# Altium project RK_NVR_DEMO1_RK3588_LP4XD200P232SD8_V21_20211228.PrjPcb (part 8 of 19)

## Sheet 25.USB2_USB3_TypeC Port.SchDoc
size 594 x 420 mm; Revision: V2.1; Schematic Page Number: 11; Page Number: 23; Check: Default; Schematic Name: RK_NVR_DEMO1_RK3588_LP4/4x_V21; Page Count: 43; Page name: 25.USB2/USB3/TypeC Port; Designer: Zhangdz; Schematic Page Count: 99; Revcode: V2.1; DsnPath: E:\Work\SBER\RK3588_SOM\temp\RK_NVR_DEMO1_RK3588_LP4XD200P232SD8_V21_20211228.DSN; SchematicName: RK_NVR_DEMO1_RK3588_LP4/4x_V21; PageName: 25.USB2/USB3/TypeC Port; PageSize: A2; TopSchematic: True
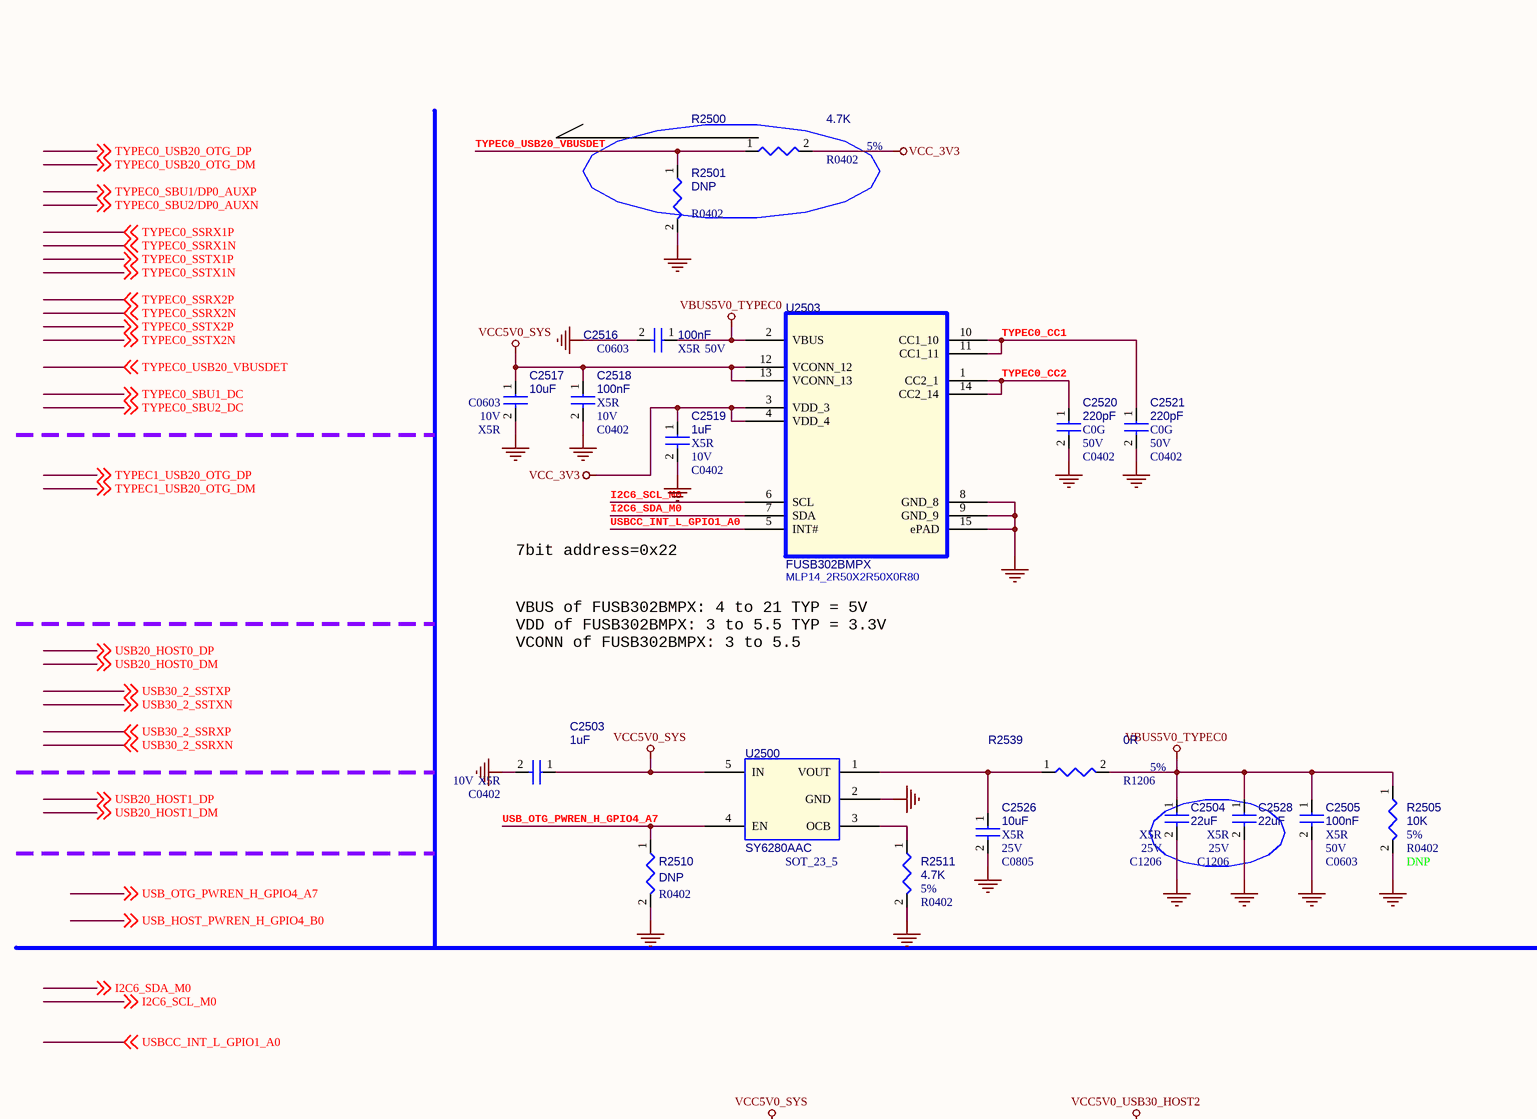
[diagram p44: 25.USB2_USB3_TypeC Port.SchDoc, top left]
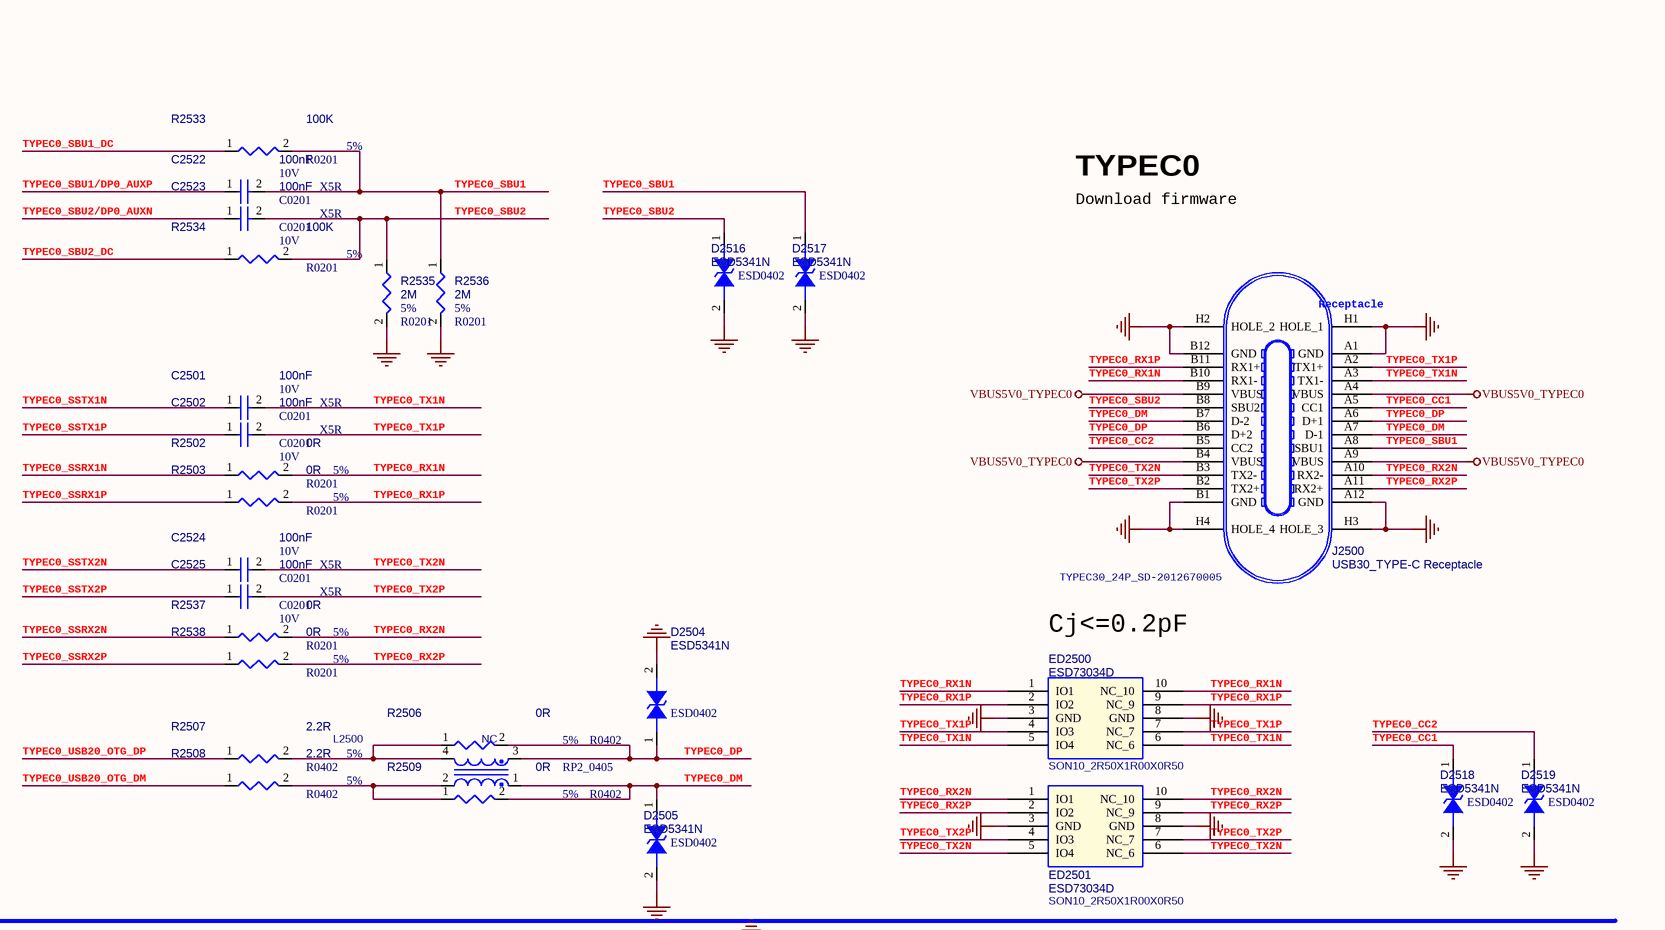
[diagram p45: 25.USB2_USB3_TypeC Port.SchDoc, top right]
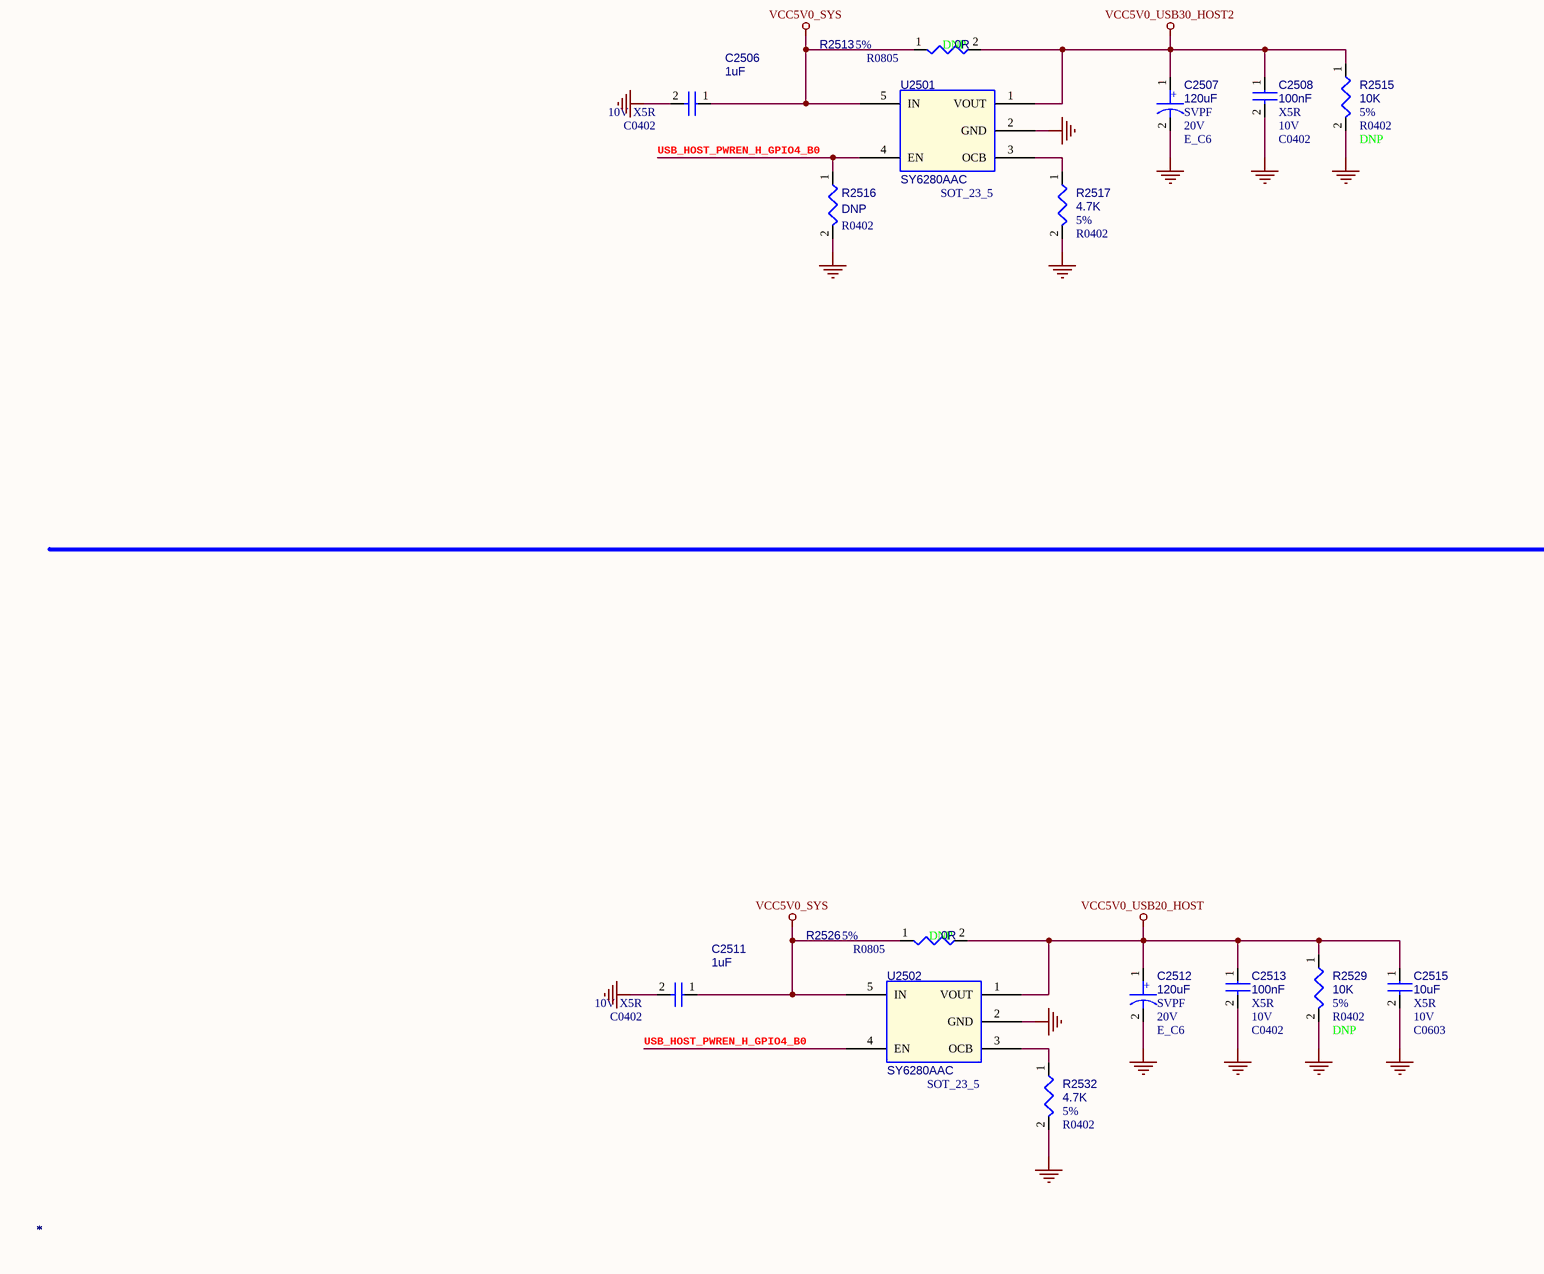
[diagram p46: 25.USB2_USB3_TypeC Port.SchDoc, bottom left]
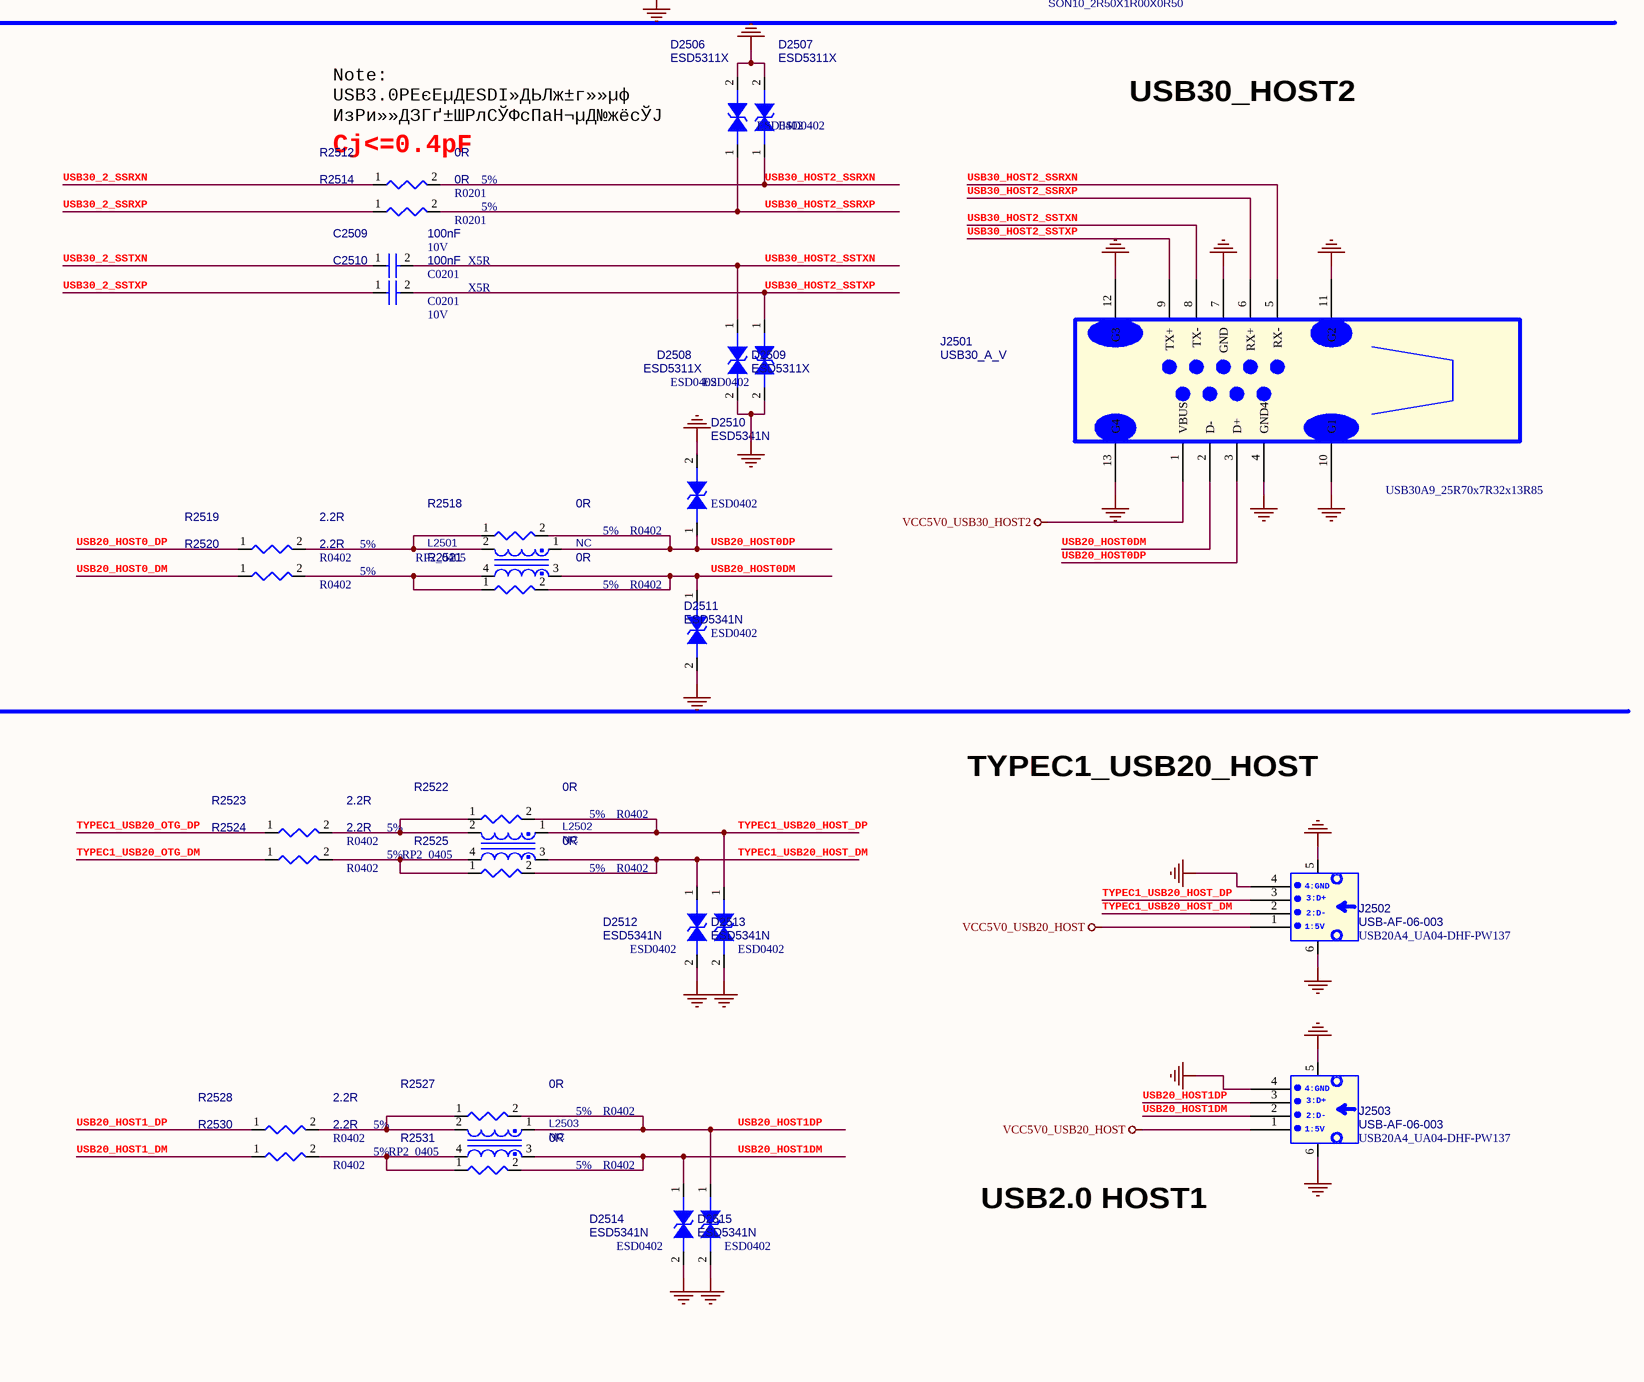
[diagram p47: 25.USB2_USB3_TypeC Port.SchDoc, bottom right]

### Parts
C2501  *  Voltage: 10V  Dielectric: X5R  [C0201]
C2502  *  Voltage: 10V  Dielectric: X5R  [C0201]
C2503  *  Voltage: 10V  Dielectric: X5R  [C0402]
C2504  *  Voltage: 25V  Dielectric: X5R  [C1206]
C2505  *  Voltage: 50V  Dielectric: X5R  [C0603]
C2506  *  Voltage: 10V  Dielectric: X5R  [C0402]
C2507  *  Voltage: 20V  Dielectric: SVPF  [E_C6]
C2508  *  Voltage: 10V  Dielectric: X5R  [C0402]
C2509  *  Voltage: 10V  Dielectric: X5R  [C0201]
C2510  *  Voltage: 10V  Dielectric: X5R  [C0201]
C2511  *  Voltage: 10V  Dielectric: X5R  [C0402]
C2512  *  Voltage: 20V  Dielectric: SVPF  [E_C6]
C2513  *  Voltage: 10V  Dielectric: X5R  [C0402]
C2515  *  Voltage: 10V  Dielectric: X5R  [C0603]
C2516  *  Voltage: 50V  Dielectric: X5R  [C0603]
C2517  *  Voltage: 10V  Dielectric: X5R  [C0603]
C2518  *  Voltage: 10V  Dielectric: X5R  [C0402]
C2519  *  Voltage: 10V  Dielectric: X5R  [C0402]
C2520  *  Voltage: 50V  Dielectric: C0G  [C0402]
C2521  *  Voltage: 50V  Dielectric: C0G  [C0402]
C2522  *  Voltage: 10V  Dielectric: X5R  [C0201]
C2523  *  Voltage: 10V  Dielectric: X5R  [C0201]
C2524  *  Voltage: 10V  Dielectric: X5R  [C0201]
C2525  *  Voltage: 10V  Dielectric: X5R  [C0201]
C2526  *  Voltage: 25V  Dielectric: X5R  [C0805]
C2528  *  Voltage: 25V  Dielectric: X5R  [C1206]
D2504  *  [ESD0402]
D2505  *  [ESD0402]
D2506  *  [ESD0402]
D2507  *  [ESD0402]
D2508  *  [ESD0402]
D2509  *  [ESD0402]
D2510  *  [ESD0402]
D2511  *  [ESD0402]
D2512  *  [ESD0402]
D2513  *  [ESD0402]
D2514  *  [ESD0402]
D2515  *  [ESD0402]
D2516  *  [ESD0402]
D2517  *  [ESD0402]
D2518  *  [ESD0402]
D2519  *  [ESD0402]
ED2500  *  [SON10_2R50X1R00X0R50]
ED2501  *  [SON10_2R50X1R00X0R50]
J2500  *  [TYPEC30_24P_SD-2012670005]
J2501  *  PCB Footprint: USB30A9_25R70x7R32x13R85  [USB30]
J2502  *  PCB Footprint: USB20A4_UA04-DHF-PW137  [USB20]
J2503  *  PCB Footprint: USB20A4_UA04-DHF-PW137  [USB20]
L2500  *  PCB Footprint: RP2_0405  [L0402D]
L2501  *  PCB Footprint: RP2_0405  [L0402D]
L2502  *  PCB Footprint: RP2_0405  [L0402D]
L2503  *  PCB Footprint: RP2_0405  [L0402D]
R2500  *  Tolerance: 5%  [R0402]
R2501  *  [R0402]
R2502  *  PCB Footprint: R0201  Tolerance: 5%  [R0402]
R2503  *  PCB Footprint: R0201  Tolerance: 5%  [R0402]
R2505  *  Tolerance: 5%  option: DNP  [R0402]
R2506  *  Tolerance: 5%  [R0402]
R2507  *  Tolerance: 5%  [R0402]
R2508  *  Tolerance: 5%  [R0402]
R2509  *  Tolerance: 5%  [R0402]
R2510  *  [R0402]
R2511  *  Tolerance: 5%  [R0402]
R2512  *  PCB Footprint: R0201  Tolerance: 5%  [R0402]
R2513  *  PCB Footprint: R0805  Tolerance: 5%  Option: DNP  [R0402]
R2514  *  PCB Footprint: R0201  Tolerance: 5%  [R0402]
R2515  *  Tolerance: 5%  option: DNP  [R0402]
R2516  *  [R0402]
R2517  *  Tolerance: 5%  [R0402]
R2518  *  Tolerance: 5%  [R0402]
R2519  *  Tolerance: 5%  [R0402]
R2520  *  Tolerance: 5%  [R0402]
R2521  *  Tolerance: 5%  [R0402]
R2522  *  Tolerance: 5%  [R0402]
R2523  *  Tolerance: 5%  [R0402]
R2524  *  Tolerance: 5%  [R0402]
R2525  *  Tolerance: 5%  [R0402]
R2526  *  PCB Footprint: R0805  Tolerance: 5%  Option: DNP  [R0402]
R2527  *  Tolerance: 5%  [R0402]
R2528  *  Tolerance: 5%  [R0402]
R2529  *  Tolerance: 5%  option: DNP  [R0402]
R2530  *  Tolerance: 5%  [R0402]
R2531  *  Tolerance: 5%  [R0402]
R2532  *  Tolerance: 5%  [R0402]
R2533  *  PCB Footprint: R0201  Tolerance: 5%  [R0402]
R2534  *  PCB Footprint: R0201  Tolerance: 5%  [R0402]
R2535  *  PCB Footprint: R0201  Tolerance: 5%  [R0402]
R2536  *  PCB Footprint: R0201  Tolerance: 5%  [R0402]
R2537  *  PCB Footprint: R0201  Tolerance: 5%  [R0402]
R2538  *  PCB Footprint: R0201  Tolerance: 5%  [R0402]
R2539  *  PCB Footprint: R1206  Tolerance: 5%  [R0402]
U2500  *  [SOT_23_5]
U2501  *  [SOT_23_5]
U2502  *  [SOT_23_5]
U2503  *  [MLP14_2R50X2R50X0R80]

### Nets
GND: C2503.2 C2504.2 C2505.2 C2506.2 C2507.2 C2508.2 C2511.2 C2512.2 C2513.2 C2515.2 C2516.2 C2517.2 C2518.2 C2519.2 C2520.2 C2521.2 C2526.2 C2528.2 D2504.2 D2505.2 D2506.2 D2507.2 D2508.2 D2509.2 D2510.2 D2511.2 D2512.2 D2513.2 D2514.2 D2515.2 D2516.2 D2517.2 D2518.2 D2519.2 ED2500.3(GND) ED2500.8(GND) ED2501.3(GND) ED2501.8(GND) J2500.A1(GND) J2500.A12(GND) J2500.B1(GND) J2500.B12(GND) J2500.H1(HOLE_1) J2500.H2(HOLE_2) J2500.H3(HOLE_3) J2500.H4(HOLE_4) J2501.4(GND4) J2501.7(GND) J2501.10(G1) J2501.11(G2) J2501.12(G3) J2501.13(G4) J2502.4 J2502.5 J2502.6 J2503.4 J2503.5 J2503.6 R2501.2 R2505.2 R2510.2 R2511.2 R2515.2 R2516.2 R2517.2 R2529.2 R2532.2 R2535.2 R2536.2 U2500.2(GND) U2501.2(GND) U2502.2(GND) U2503.8(GND_8) U2503.9(GND_9) U2503.15(ePAD)
VBUS5V0_TYPEC0: C2504.1 C2505.1 C2516.1 C2528.1 J2500.A4(VBUS) J2500.A9(VBUS) J2500.B4(VBUS) J2500.B9(VBUS) R2505.1 R2539.2 U2503.2(VBUS)
VCC5V0_SYS: C2503.1 C2506.1 C2511.1 C2517.1 C2518.1 R2513.1 R2526.1 U2500.5(IN) U2501.5(IN) U2502.5(IN) U2503.12(VCONN_12) U2503.13(VCONN_13)
VCC5V0_USB20_HOST: C2512.1 C2513.1 C2515.1 J2502.1 J2503.1 R2526.2 R2529.1 U2502.1(VOUT)
VCC5V0_USB30_HOST2: C2507.1 C2508.1 J2501.1(VBUS) R2513.2 R2515.1 U2501.1(VOUT)
VCC_3V3: C2519.1 R2500.2 U2503.3(VDD_3) U2503.4(VDD_4)
I2C6_SCL_M0: U2503.6(SCL) ; off-sheet I2C6_SCL_M0
I2C6_SDA_M0: U2503.7(SDA) ; off-sheet I2C6_SDA_M0
TYPEC0_CC1: C2521.1 D2518.1 J2500.A5(CC1) U2503.10(CC1_10) U2503.11(CC1_11)
TYPEC0_CC2: C2520.1 D2519.1 J2500.B5(CC2) U2503.1(CC2_1) U2503.14(CC2_14)
TYPEC0_DM: D2505.1 J2500.A7(D-1) J2500.B7(D-2) L2500.1 R2509.2
TYPEC0_DP: D2504.1 J2500.A6(D+1) J2500.B6(D+2) L2500.3 R2506.2
TYPEC0_RX1N: ED2500.1(IO1) ED2500.10(NC_10) J2500.B10(RX1-) R2502.2
TYPEC0_RX1P: ED2500.2(IO2) ED2500.9(NC_9) J2500.B11(RX1+) R2503.2
TYPEC0_RX2N: ED2501.1(IO1) ED2501.10(NC_10) J2500.A10(RX2-) R2537.2
TYPEC0_RX2P: ED2501.2(IO2) ED2501.9(NC_9) J2500.A11(RX2+) R2538.2
TYPEC0_SBU1: C2522.2 D2517.1 J2500.A8(SBU1) R2533.2 R2536.1
TYPEC0_SBU1/DP0_AUXP: C2522.1 ; off-sheet TYPEC0_SBU1/DP0_AUXP
TYPEC0_SBU1_DC: R2533.1 ; off-sheet TYPEC0_SBU1_DC
TYPEC0_SBU2: C2523.2 D2516.1 J2500.B8(SBU2) R2534.2 R2535.1
TYPEC0_SBU2/DP0_AUXN: C2523.1 ; off-sheet TYPEC0_SBU2/DP0_AUXN
TYPEC0_SBU2_DC: R2534.1 ; off-sheet TYPEC0_SBU2_DC
TYPEC0_SSRX1N: R2502.1 ; off-sheet TYPEC0_SSRX1N
TYPEC0_SSRX1P: R2503.1 ; off-sheet TYPEC0_SSRX1P
TYPEC0_SSRX2N: R2537.1 ; off-sheet TYPEC0_SSRX2N
TYPEC0_SSRX2P: R2538.1 ; off-sheet TYPEC0_SSRX2P
TYPEC0_SSTX1N: C2501.1 ; off-sheet TYPEC0_SSTX1N
TYPEC0_SSTX1P: C2502.1 ; off-sheet TYPEC0_SSTX1P
TYPEC0_SSTX2N: C2524.1 ; off-sheet TYPEC0_SSTX2N
TYPEC0_SSTX2P: C2525.1 ; off-sheet TYPEC0_SSTX2P
TYPEC0_TX1N: C2501.2 ED2500.5(IO4) ED2500.6(NC_6) J2500.A3(TX1-)
TYPEC0_TX1P: C2502.2 ED2500.4(IO3) ED2500.7(NC_7) J2500.A2(TX1+)
TYPEC0_TX2N: C2524.2 ED2501.5(IO4) ED2501.6(NC_6) J2500.B3(TX2-)
TYPEC0_TX2P: C2525.2 ED2501.4(IO3) ED2501.7(NC_7) J2500.B2(TX2+)
TYPEC0_USB20_OTG_DM: R2508.1 ; off-sheet TYPEC0_USB20_OTG_DM
TYPEC0_USB20_OTG_DP: R2507.1 ; off-sheet TYPEC0_USB20_OTG_DP
TYPEC0_USB20_VBUSDET: R2500.1 R2501.1 ; off-sheet TYPEC0_USB20_VBUSDET
TYPEC1_USB20_HOST_DM: D2512.1 J2502.2 L2502.3 R2525.2
TYPEC1_USB20_HOST_DP: D2513.1 J2502.3 L2502.1 R2522.2
TYPEC1_USB20_OTG_DM: R2524.1 ; off-sheet TYPEC1_USB20_OTG_DM
TYPEC1_USB20_OTG_DP: R2523.1 ; off-sheet TYPEC1_USB20_OTG_DP
USB20_HOST0_DM: R2520.1 ; off-sheet USB20_HOST0_DM
USB20_HOST0_DP: R2519.1 ; off-sheet USB20_HOST0_DP
USB20_HOST0DM: D2511.1 J2501.2(D-) L2501.3 R2521.2
USB20_HOST0DP: D2510.1 J2501.3(D+) L2501.1 R2518.2
USB20_HOST1_DM: R2530.1 ; off-sheet USB20_HOST1_DM
USB20_HOST1_DP: R2528.1 ; off-sheet USB20_HOST1_DP
USB20_HOST1DM: D2514.1 J2503.2 L2503.3 R2531.2
USB20_HOST1DP: D2515.1 J2503.3 L2503.1 R2527.2
USB30_2_SSRXN: R2512.1 ; off-sheet USB30_2_SSRXN
USB30_2_SSRXP: R2514.1 ; off-sheet USB30_2_SSRXP
USB30_2_SSTXN: C2509.1 ; off-sheet USB30_2_SSTXN
USB30_2_SSTXP: C2510.1 ; off-sheet USB30_2_SSTXP
USB30_HOST2_SSRXN: D2507.1 J2501.5(RX-) R2512.2
USB30_HOST2_SSRXP: D2506.1 J2501.6(RX+) R2514.2
USB30_HOST2_SSTXN: C2509.2 D2508.1 J2501.8(TX-)
USB30_HOST2_SSTXP: C2510.2 D2509.1 J2501.9(TX+)
USB_HOST_PWREN_H_GPIO4_B0: R2516.1 U2501.4(EN) U2502.4(EN) ; off-sheet USB_HOST_PWREN_H_GPIO4_B0
USB_OTG_PWREN_H_GPIO4_A7: R2510.1 U2500.4(EN) ; off-sheet USB_OTG_PWREN_H_GPIO4_A7
USBCC_INT_L_GPIO1_A0: U2503.5(INT#) ; off-sheet USBCC_INT_L_GPIO1_A0
NetC2526_1: C2526.1 R2539.1 U2500.1(VOUT)
NetL2500_2: L2500.2 R2508.2 R2509.1
NetL2500_4: L2500.4 R2506.1 R2507.2
NetL2501_2: L2501.2 R2518.1 R2519.2
NetL2501_4: L2501.4 R2520.2 R2521.1
NetL2502_2: L2502.2 R2522.1 R2523.2
NetL2502_4: L2502.4 R2524.2 R2525.1
NetL2503_2: L2503.2 R2527.1 R2528.2
NetL2503_4: L2503.4 R2530.2 R2531.1
NetR2511_1: R2511.1 U2500.3(OCB)
NetR2517_1: R2517.1 U2501.3(OCB)
NetR2532_1: R2532.1 U2502.3(OCB)

### Notes on the sheet
- TYPEC0
- Download firmware
- 7bit address=0x22
- VBUS of FUSB302BMPX: 4 to 21 TYP = 5V
  VDD of FUSB302BMPX: 3 to 5.5 TYP = 3.3V
  VCONN of FUSB302BMPX: 3 to 5.5
- (near ED2500) Cj<=0.2pF
- Note:
  USB3.0РЕєЕµДESDІ»ДЬЛж±г»»µф
  ИзРи»»ДЗГґ±ШРлСЎФсПаН¬µД№жёсЎЈ
- USB30_HOST2
- (near R2512) Cj<=0.4pF
- TYPEC1_USB20_HOST
- USB2.0 HOST1
- (in symbol CAP) +
- (in symbol USB20_TYPE_A) 4:GND; 3:D+; 2:D-; 1:5V
- (in symbol USB30_TYPE-C Receptacle_0) Receptacle

### Library data of the parts
C2501 = CAP NP: cap,100.00nF,+/-10%,10V,X5R,C0201; Part Reference: C2501; Manufacturer PN: C0603X5R1A104K030BC; Manufacturer: TDK; Value: 100nF; C_Voltage: 6.3V; Tolerance: 10%; Priority: A; Number: 37; PCB Footprint: C0201; Created by: JJJ; Part Type: C0201; RK PN: C0603X5R1A104K030BC
C2502 = CAP NP: cap,100.00nF,+/-10%,10V,X5R,C0201; Part Reference: C2502; Manufacturer PN: C0603X5R1A104K030BC; Manufacturer: TDK; Value: 100nF; C_Voltage: 6.3V; Tolerance: 10%; Priority: A; Number: 37; PCB Footprint: C0201; Created by: JJJ; Part Type: C0201; RK PN: C0603X5R1A104K030BC
C2503 = CAP NP: cap,1.00uF,+/-10%,10V,X5R,C0402; Part Reference: C2503; Manufacturer PN: C1005X5R1A105K050BB; Manufacturer: TDK; Value: 1uF; Tolerance: 10%; C_Voltage: 6.3V; Priority: A; PCB Footprint: C0402; Created by: JJJ; Part Type: C0402; RK PN: C1005X5R1A105K050BB
C2504 = CAP NP: cap,22.00uF,+/-20%,25V,X5R,C1206; Part Reference: C2504; Manufacturer PN: C3216X5R1E226M160AB; Manufacturer: TDK; Value: 22uF; Tolerance: 20%; C_Voltage: 6.3V; Priority: A; PCB Footprint: C1206; Created by: JJJ; Part Type: C1206; RK PN: C3216X5R1E226M160AB
C2505 = CAP NP: cap,100.00nF,+/-10%,50V,X5R,C0603; Part Reference: C2505; Manufacturer: TDK; Value: 100nF; RK PN: C1608X5R1H104K080AA; Priority: A; Tolerance: 10%; PCB Footprint: C0603; Part Type: C0603; Manufacturer PN: C1608X5R1H104K080AA; Created by: JJJ
C2506 = CAP NP: cap,1.00uF,+/-10%,10V,X5R,C0402; Part Reference: C2506; Manufacturer PN: C1005X5R1A105K050BB; Manufacturer: TDK; Value: 1uF; Tolerance: 10%; C_Voltage: 6.3V; Priority: A; PCB Footprint: C0402; Created by: JJJ; Part Type: C0402; RK PN: C1005X5R1A105K050BB
C2507 = CAP: 120uF,20V,25mR,SVPF; Part Reference: C2507; Manufacturer: Panasonic; RK PN: 20SVPF120M; Priority: A; Tolerance: 20%; PCB Footprint: E_C6; Value: 120uF; Part Type: МщЖ¬№ММ¬ВБµзЅв; Manufacturer PN: 20SVPF120M; Created by: YWQ
C2508 = CAP NP: cap,100.00nF,+/-10%,10V,X5R,C0402; Part Reference: C2508; Manufacturer PN: C1005X5R1A104K050BA; Manufacturer: TDK; Value: 100nF; Tolerance: 10%; Priority: A; PCB Footprint: C0402; Created by: JJJ; Part Type: C0402; RK PN: C1005X5R1A104K050BA
C2509 = CAP NP: cap,100.00nF,+/-10%,10V,X5R,C0201; Part Reference: C2509; Manufacturer PN: C0603X5R1A104K030BC; Manufacturer: TDK; Value: 100nF; C_Voltage: 6.3V; Tolerance: 10%; Priority: A; Number: 37; PCB Footprint: C0201; Created by: JJJ; Part Type: C0201; RK PN: C0603X5R1A104K030BC
C2510 = CAP NP: cap,100.00nF,+/-10%,10V,X5R,C0201; Part Reference: C2510; Manufacturer PN: C0603X5R1A104K030BC; Manufacturer: TDK; Value: 100nF; C_Voltage: 6.3V; Tolerance: 10%; Priority: A; Number: 37; PCB Footprint: C0201; Created by: JJJ; Part Type: C0201; RK PN: C0603X5R1A104K030BC
C2511 = CAP NP: cap,1.00uF,+/-10%,10V,X5R,C0402; Part Reference: C2511; Manufacturer PN: C1005X5R1A105K050BB; Manufacturer: TDK; Value: 1uF; Tolerance: 10%; C_Voltage: 6.3V; Priority: A; PCB Footprint: C0402; Created by: JJJ; Part Type: C0402; RK PN: C1005X5R1A105K050BB
C2512 = CAP: 120uF,20V,25mR,SVPF; Part Reference: C2512; Manufacturer PN: 20SVPF120M; Manufacturer: Panasonic; Tolerance: 20%; Priority: A; PCB Footprint: E_C6; Value: 120uF; Created by: YWQ; Part Type: МщЖ¬№ММ¬ВБµзЅв; RK PN: 20SVPF120M
C2513 = CAP NP: cap,100.00nF,+/-10%,10V,X5R,C0402; Part Reference: C2513; Manufacturer: TDK; Value: 100nF; RK PN: C1005X5R1A104K050BA; Priority: A; Tolerance: 10%; PCB Footprint: C0402; Part Type: C0402; Manufacturer PN: C1005X5R1A104K050BA; Created by: JJJ
C2515 = CAP NP: cap,10.00uF,+/-10%,10V,X5R,C0603; Part Reference: C2515; Manufacturer PN: C1608X5R1A106K080AC; Manufacturer: TDK; Value: 10uF; Tolerance: 10%; Priority: A; PCB Footprint: C0603; Created by: JJJ; Part Type: C0603; RK PN: C1608X5R1A106K080AC
C2516 = CAP NP: cap,100.00nF,+/-10%,50V,X5R,C0603; Part Reference: C2516; Manufacturer PN: C1608X5R1H104K080AA; Manufacturer: TDK; Value: 100nF; C_Voltage: 6.3V; Tolerance: 10%; Priority: A; Number: 37; PCB Footprint: C0603; Created by: JJJ; Part Type: C0603; RK PN: C1608X5R1H104K080AA
C2517 = CAP NP: cap,10.00uF,+/-10%,10V,X5R,C0603; Part Reference: C2517; Manufacturer: TDK; Value: 10uF; RK PN: C1608X5R1A106K080AC; Priority: A; Tolerance: 10%; PCB Footprint: C0603; Part Type: C0603; Manufacturer PN: C1608X5R1A106K080AC; Created by: JJJ
C2518 = CAP NP: cap,100.00nF,+/-10%,10V,X5R,C0402; Part Reference: C2518; Manufacturer PN: C1005X5R1A104K050BA; Manufacturer: TDK; Value: 100nF; C_Voltage: 6.3V; Tolerance: 10%; Priority: A; Number: 37; PCB Footprint: C0402; Created by: JJJ; Part Type: C0402; RK PN: C1005X5R1A104K050BA
C2519 = CAP NP: cap,1.00uF,+/-10%,10V,X5R,C0402; Part Reference: C2519; Manufacturer PN: C1005X5R1A105K050BB; Manufacturer: TDK; Value: 1uF; C_Voltage: 6.3V; Tolerance: 10%; Priority: A; Number: 37; PCB Footprint: C0402; Created by: JJJ; Part Type: C0402; RK PN: C1005X5R1A105K050BB
C2520 = CAP NP: cap,220.00pF,+/-10%,50V,C0G,C0402; Part Reference: C2520; Manufacturer: TDK; Value: 220pF; RK PN: C1005C0G1H221K050BA; Priority: A; Tolerance: 10%; PCB Footprint: C0402; Part Type: C0402; Manufacturer PN: C1005C0G1H221K050BA; Created by: JJJ
C2521 = CAP NP: cap,220.00pF,+/-10%,50V,C0G,C0402; Part Reference: C2521; Manufacturer: TDK; Value: 220pF; RK PN: C1005C0G1H221K050BA; Priority: A; Tolerance: 10%; PCB Footprint: C0402; Part Type: C0402; Manufacturer PN: C1005C0G1H221K050BA; Created by: JJJ
C2522 = CAP NP: cap,100.00nF,+/-10%,10V,X5R,C0201; Part Reference: C2522; Manufacturer: TDK; Value: 100nF; Number: 37; RK PN: C0603X5R1A104K030BC; Priority: A; Tolerance: 10%; C_Voltage: 6.3V; PCB Footprint: C0201; Part Type: C0201; Manufacturer PN: C0603X5R1A104K030BC; Created by: JJJ
C2523 = CAP NP: cap,100.00nF,+/-10%,10V,X5R,C0201; Part Reference: C2523; Manufacturer: TDK; Value: 100nF; Number: 37; RK PN: C0603X5R1A104K030BC; Priority: A; Tolerance: 10%; C_Voltage: 6.3V; PCB Footprint: C0201; Part Type: C0201; Manufacturer PN: C0603X5R1A104K030BC; Created by: JJJ
C2524 = CAP NP: cap,100.00nF,+/-10%,10V,X5R,C0201; Part Reference: C2524; Manufacturer PN: C0603X5R1A104K030BC; Manufacturer: TDK; Value: 100nF; C_Voltage: 6.3V; Tolerance: 10%; Priority: A; Number: 37; PCB Footprint: C0201; Created by: JJJ; Part Type: C0201; RK PN: C0603X5R1A104K030BC
C2525 = CAP NP: cap,100.00nF,+/-10%,10V,X5R,C0201; Part Reference: C2525; Manufacturer PN: C0603X5R1A104K030BC; Manufacturer: TDK; Value: 100nF; C_Voltage: 6.3V; Tolerance: 10%; Priority: A; Number: 37; PCB Footprint: C0201; Created by: JJJ; Part Type: C0201; RK PN: C0603X5R1A104K030BC
C2526 = CAP NP: cap,10.00uF,+/-10%,25V,X5R,C0805; Part Reference: C2526; Manufacturer PN: C2012X5R1E106K085AC; Manufacturer: TDK; Value: 10uF; Tolerance: 10%; Priority: A; PCB Footprint: C0805; Created by: JJJ; Part Type: C0805; RK PN: C2012X5R1E106K085AC
C2528 = CAP NP: cap,22.00uF,+/-20%,25V,X5R,C1206; Part Reference: C2528; Manufacturer: TDK; Value: 22uF; RK PN: C3216X5R1E226M160AB; Priority: A; C_Voltage: 6.3V; Tolerance: 20%; PCB Footprint: C1206; Part Type: C1206; Manufacturer PN: C3216X5R1E226M160AB; Created by: JJJ
D2504 = DIODE BI_DIR TRIG: 1-Line, Bi-directional, Transient Voltage Suppressors.1pF.; Part Reference: D2504; Manufacturer: WillSemi(О¤¶ы°лµјМе); Value: ESD5341N; Priority: A; PCB Footprint: ESD0402; RK PN: ESD5341N; Part Type: ESD_TVS; Manufacturer PN: ESD5341N; Created by: JJJ
D2505 = DIODE BI_DIR TRIG: 1-Line, Bi-directional, Transient Voltage Suppressors.1pF.; Part Reference: D2505; Manufacturer: WillSemi(О¤¶ы°лµјМе); Value: ESD5341N; Priority: A; PCB Footprint: ESD0402; Created by: JJJ; Manufacturer PN: ESD5341N; Part Type: ESD_TVS; RK PN: ESD5341N
D2506 = DIODE BI_DIR TRIG: 1-Line, Bi-directional, Transient Voltage Suppressors.0.25pF.; Part Reference: D2506; Manufacturer: WillSemi(О¤¶ы°лµјМе); Value: ESD5311X; RK PN: ESD5311N; Priority: A; PCB Footprint: ESD0402; Part Type: ESD_TVS; Manufacturer PN: ESD5311N; Created by: JJJ
D2507 = DIODE BI_DIR TRIG: 1-Line, Bi-directional, Transient Voltage Suppressors.0.25pF.; Part Reference: D2507; Manufacturer PN: ESD5311N; Manufacturer: WillSemi(О¤¶ы°лµјМе); Value: ESD5311X; Priority: A; PCB Footprint: ESD0402; Created by: JJJ; Part Type: ESD_TVS; RK PN: ESD5311N
D2508 = DIODE BI_DIR TRIG: 1-Line, Bi-directional, Transient Voltage Suppressors.0.25pF.; Part Reference: D2508; Manufacturer PN: ESD5311N; Manufacturer: WillSemi(О¤¶ы°лµјМе); Value: ESD5311X; Priority: A; PCB Footprint: ESD0402; Created by: JJJ; Part Type: ESD_TVS; RK PN: ESD5311N
D2509 = DIODE BI_DIR TRIG: 1-Line, Bi-directional, Transient Voltage Suppressors.0.25pF.; Part Reference: D2509; Manufacturer: WillSemi(О¤¶ы°лµјМе); Value: ESD5311X; RK PN: ESD5311N; Priority: A; PCB Footprint: ESD0402; Part Type: ESD_TVS; Manufacturer PN: ESD5311N; Created by: JJJ
D2510 = DIODE BI_DIR TRIG: 1-Line, Bi-directional, Transient Voltage Suppressors.1pF.; Part Reference: D2510; Manufacturer: WillSemi(О¤¶ы°лµјМе); Value: ESD5341N; Priority: A; PCB Footprint: ESD0402; Created by: JJJ; Manufacturer PN: ESD5341N; Part Type: ESD_TVS; RK PN: ESD5341N
D2511 = DIODE BI_DIR TRIG: 1-Line, Bi-directional, Transient Voltage Suppressors.1pF.; Part Reference: D2511; Manufacturer: WillSemi(О¤¶ы°лµјМе); Value: ESD5341N; Priority: A; PCB Footprint: ESD0402; RK PN: ESD5341N; Part Type: ESD_TVS; Manufacturer PN: ESD5341N; Created by: JJJ
D2512 = DIODE BI_DIR TRIG: 1-Line, Bi-directional, Transient Voltage Suppressors.1pF.; Part Reference: D2512; Manufacturer: WillSemi(О¤¶ы°лµјМе); Value: ESD5341N; Priority: A; PCB Footprint: ESD0402; Created by: JJJ; Manufacturer PN: ESD5341N; Part Type: ESD_TVS; RK PN: ESD5341N
D2513 = DIODE BI_DIR TRIG: 1-Line, Bi-directional, Transient Voltage Suppressors.1pF.; Part Reference: D2513; Manufacturer: WillSemi(О¤¶ы°лµјМе); Value: ESD5341N; Priority: A; PCB Footprint: ESD0402; RK PN: ESD5341N; Part Type: ESD_TVS; Manufacturer PN: ESD5341N; Created by: JJJ
D2514 = DIODE BI_DIR TRIG: 1-Line, Bi-directional, Transient Voltage Suppressors.1pF.; Part Reference: D2514; Manufacturer: WillSemi(О¤¶ы°лµјМе); Value: ESD5341N; Priority: A; PCB Footprint: ESD0402; Created by: JJJ; Manufacturer PN: ESD5341N; Part Type: ESD_TVS; RK PN: ESD5341N
D2515 = DIODE BI_DIR TRIG: 1-Line, Bi-directional, Transient Voltage Suppressors.1pF.; Part Reference: D2515; Manufacturer: WillSemi(О¤¶ы°лµјМе); Value: ESD5341N; Priority: A; PCB Footprint: ESD0402; RK PN: ESD5341N; Part Type: ESD_TVS; Manufacturer PN: ESD5341N; Created by: JJJ
D2516 = DIODE BI_DIR TRIG: 1-Line, Bi-directional, Transient Voltage Suppressors.1pF.; Part Reference: D2516; Manufacturer: WillSemi(О¤¶ы°лµјМе); Value: ESD5341N; Priority: A; PCB Footprint: ESD0402; RK PN: ESD5341N; Part Type: ESD_TVS; Manufacturer PN: ESD5341N; Created by: JJJ
D2517 = DIODE BI_DIR TRIG: 1-Line, Bi-directional, Transient Voltage Suppressors.1pF.; Part Reference: D2517; Manufacturer: WillSemi(О¤¶ы°лµјМе); Value: ESD5341N; Priority: A; PCB Footprint: ESD0402; Created by: JJJ; Manufacturer PN: ESD5341N; Part Type: ESD_TVS; RK PN: ESD5341N
D2518 = DIODE BI_DIR TRIG: 1-Line, Bi-directional, Transient Voltage Suppressors.1pF.; Part Reference: D2518; Manufacturer: WillSemi(О¤¶ы°лµјМе); Value: ESD5341N; Priority: A; PCB Footprint: ESD0402; RK PN: ESD5341N; Part Type: ESD_TVS; Manufacturer PN: ESD5341N; Created by: JJJ
D2519 = DIODE BI_DIR TRIG: 1-Line, Bi-directional, Transient Voltage Suppressors.1pF.; Part Reference: D2519; Manufacturer: WillSemi(О¤¶ы°лµјМе); Value: ESD5341N; Priority: A; PCB Footprint: ESD0402; RK PN: ESD5341N; Part Type: ESD_TVS; Manufacturer PN: ESD5341N; Created by: JJJ
ED2500 = ESD_ESD5304D: 4-Lines, Uni-directional, Ultra-low Capacitance Transient Voltage Suppressors; Part Reference: ED2500; Manufacturer: WillSemi(О¤¶ы°лµјМе); Value: ESD73034D; Priority: A; PCB Footprint: SON10_2R50X1R00X0R50; Created by: JJJ; Manufacturer PN: ESD5304D; Part Type: ESD_TVS; RK PN: ESD5304D
ED2501 = ESD_ESD5304D: 4-Lines, Uni-directional, Ultra-low Capacitance Transient Voltage Suppressors; Part Reference: ED2501; Manufacturer: WillSemi(О¤¶ы°лµјМе); Value: ESD73034D; Priority: A; PCB Footprint: SON10_2R50X1R00X0R50; RK PN: ESD5304D; Part Type: ESD_TVS; Manufacturer PN: ESD5304D; Created by: JJJ
J2500 = USB30_TYPE-C Receptacle_0: USB Type-CОФКЅДёЧщЈ¬Мщєё; Part Reference: J2500; Manufacturer Part Number: USB_TYPE-C-31-M-05; Manufacturer: є«ИЩ; Priority: A; Value: USB30_TYPE-C Receptacle; PCB Footprint: TYPEC30_24P_SD-2012670005; Created by: YWQ; Part Type: USB Jack; RK PN: USB_TYPE-C-31-M-05
J2501 = USB30_TYPE_A_V_2: USB3.0 AРНЈ¬ІаІеЈ¬ДёЧщЈ¬Іеєё; Part Reference: J2501; Manufacturer: мч»ЄµзЧУ; Manufacturer Part Number: UA09-SHF-PU03; Value: USB30_A_V; RK PN: UA09-SHF-PU03-30; Priority: A; Part Type: USB Jack; Created by: YWQ
J2502 = USB20_TYPE_A: USB2.0 AРНБўКЅЦ±ІеНдЅЕДёЧщЈ¬Іеєё; Part Reference: J2502; Manufacturer: НъїЖґп; Value: USB-AF-06-003; Priority: A; RK PN: USB-AF-06-003; Part Type: USB Jack; Manufacturer Part Number: USB-AF-06-003; Created by: YWQ
J2503 = USB20_TYPE_A: USB2.0 AРНБўКЅЦ±ІеНдЅЕДёЧщЈ¬Іеєё; Part Reference: J2503; Manufacturer: НъїЖґп; Value: USB-AF-06-003; Priority: A; RK PN: USB-AF-06-003; Part Type: USB Jack; Manufacturer Part Number: USB-AF-06-003; Created by: YWQ
L2500 = INDUCTOR COM: Winding Type Common Mode Choke Coil; Part Reference: L2500; Manufacturer PN: SDCW2012-2-900TF; Manufacturer: sunlord; Value: NC; Resonace frequency: 90R@100M; Irms: 330mA; Tolerance: 25%; DC Resistor: 0.35ohm; Priority: A; Created by: JJJ; Part Type: IND; RK PN: SDCW2012-2-900TF
L2501 = INDUCTOR COM: Winding Type Common Mode Choke Coil; Part Reference: L2501; Manufacturer PN: SDCW2012-2-900TF; Manufacturer: sunlord; Value: NC; Resonace frequency: 90R@100M; Irms: 330mA; Tolerance: 25%; DC Resistor: 0.35ohm; Priority: A; Created by: JJJ; Part Type: IND; RK PN: SDCW2012-2-900TF
L2502 = INDUCTOR COM: Winding Type Common Mode Choke Coil; Part Reference: L2502; Manufacturer: sunlord; Value: NC; RK PN: SDCW2012-2-900TF; Priority: A; DC Resistor: 0.35ohm; Tolerance: 25%; Irms: 330mA; Resonace frequency: 90R@100M; Part Type: IND; Manufacturer PN: SDCW2012-2-900TF; Created by: JJJ
L2503 = INDUCTOR COM: Winding Type Common Mode Choke Coil; Part Reference: L2503; Manufacturer: sunlord; Value: NC; RK PN: SDCW2012-2-900TF; Priority: A; DC Resistor: 0.35ohm; Tolerance: 25%; Irms: 330mA; Resonace frequency: 90R@100M; Part Type: IND; Manufacturer PN: SDCW2012-2-900TF; Created by: JJJ
R2500 = RESISTOR_Dup1: НЁУГєсД¤µзЧи,4K7,+/-5%,R0402,1/16W.; Part Reference: R2500; Manufacturer: YAGEO; Value: 4.7K; RK PN: RC0402JR-074K7L; Priority: A; Wattage: 1/16W; PCB Footprint: R0402; Part Type: НЁУГєсД¤µзЧи; Manufacturer PN: RC0402JR-074K7L; Created by: YTL
R2501 = RESISTOR_Dup1: Did Not Place.; Part Reference: R2501; Manufacturer PN: DNPR0402; Value: DNP; Priority: A; PCB Footprint: R0402; Created by: JJJ; Part Type: DNP; RK PN: DNPR0402
R2502 = RESISTOR_Dup1: НЁУГєсД¤µзЧи,0R,+/-5%,R0201,1/20W.; Part Reference: R2502; Manufacturer: YAGEO; RK PN: RC0201JR-070RL; Priority: A; Wattage: 1/20W; Value: 0R; Part Type: НЁУГєсД¤µзЧи; Manufacturer PN: RC0201JR-070RL; Created by: YTL
R2503 = RESISTOR_Dup1: НЁУГєсД¤µзЧи,0R,+/-5%,R0201,1/20W.; Part Reference: R2503; Manufacturer: YAGEO; RK PN: RC0201JR-070RL; Priority: A; Wattage: 1/20W; Value: 0R; Part Type: НЁУГєсД¤µзЧи; Manufacturer PN: RC0201JR-070RL; Created by: YTL
R2505 = RESISTOR_Dup1: НЁУГєсД¤µзЧи,10K,+/-5%,R0402,1/16W.; Part Reference: R2505; Manufacturer: YAGEO; RK PN: RC0402JR-0710KL; Priority: A; Wattage: 1/16W; PCB Footprint: R0402; Value: 10K; Part Type: НЁУГєсД¤µзЧи; Manufacturer PN: RC0402JR-0710KL; Created by: YTL
R2506 = RESISTOR_Dup1: НЁУГєсД¤µзЧи,0R,+/-5%,R0402,1/16W.; Part Reference: R2506; Manufacturer PN: RC0402JR-070RL; Manufacturer: YAGEO; Wattage: 1/16W; Priority: A; PCB Footprint: R0402; Value: 0R; Created by: YTL; Part Type: НЁУГєсД¤µзЧи; RK PN: RC0402JR-070RL
R2507 = RESISTOR_Dup1: НЁУГєсД¤µзЧи,2R2,+/-5%,R0402,1/16W.; Part Reference: R2507; Manufacturer PN: RC0402JR-072R2L; Manufacturer: YAGEO; Value: 2.2R; Wattage: 1/16W; Priority: A; PCB Footprint: R0402; Created by: YTL; Part Type: НЁУГєсД¤µзЧи; RK PN: RC0402JR-072R2L
R2508 = RESISTOR_Dup1: НЁУГєсД¤µзЧи,2R2,+/-5%,R0402,1/16W.; Part Reference: R2508; Manufacturer PN: RC0402JR-072R2L; Manufacturer: YAGEO; Value: 2.2R; Wattage: 1/16W; Priority: A; PCB Footprint: R0402; Created by: YTL; Part Type: НЁУГєсД¤µзЧи; RK PN: RC0402JR-072R2L
R2509 = RESISTOR_Dup1: НЁУГєсД¤µзЧи,0R,+/-5%,R0402,1/16W.; Part Reference: R2509; Manufacturer: YAGEO; RK PN: RC0402JR-070RL; Priority: A; Wattage: 1/16W; PCB Footprint: R0402; Value: 0R; Part Type: НЁУГєсД¤µзЧи; Manufacturer PN: RC0402JR-070RL; Created by: YTL
R2510 = RESISTOR_Dup1: Did Not Place.; Part Reference: R2510; Manufacturer PN: DNP0402; Tolerance: 0%; Value: DNP; Priority: A; PCB Footprint: R0402; Created by: JJJ; Part Type: DNP; RK PN: DNP0402
R2511 = RESISTOR_Dup1: НЁУГєсД¤µзЧи,4K7,+/-5%,R0402,1/16W.; Part Reference: R2511; Manufacturer PN: RC0402JR-074K7L; Manufacturer: YAGEO; Value: 4.7K; Wattage: 1/16W; Priority: A; PCB Footprint: R0402; Created by: YTL; Part Type: НЁУГєсД¤µзЧи; RK PN: RC0402JR-074K7L
R2512 = RESISTOR_Dup1: НЁУГєсД¤µзЧи,0R,+/-5%,R0201,1/20W.; Part Reference: R2512; Manufacturer: YAGEO; RK PN: RC0201JR-070RL; Priority: A; Wattage: 1/20W; Value: 0R; Part Type: НЁУГєсД¤µзЧи; Manufacturer PN: RC0201JR-070RL; Created by: YTL
R2513 = RESISTOR_Dup1: НЁУГєсД¤µзЧи,0R,+/-5%,R0805,1/8W.; Part Reference: R2513; Manufacturer: YAGEO; RK PN: RC0805JR-070RL; Priority: A; Wattage: 1/8W; Value: 0R; Part Type: НЁУГєсД¤µзЧи; Manufacturer PN: RC0805JR-070RL; Created by: YTL
R2514 = RESISTOR_Dup1: НЁУГєсД¤µзЧи,0R,+/-5%,R0201,1/20W.; Part Reference: R2514; Manufacturer: YAGEO; RK PN: RC0201JR-070RL; Priority: A; Wattage: 1/20W; Value: 0R; Part Type: НЁУГєсД¤µзЧи; Manufacturer PN: RC0201JR-070RL; Created by: YTL
R2515 = RESISTOR_Dup1: НЁУГєсД¤µзЧи,10K,+/-5%,R0402,1/16W.; Part Reference: R2515; Manufacturer: YAGEO; RK PN: RC0402JR-0710KL; Priority: A; Wattage: 1/16W; PCB Footprint: R0402; Value: 10K; Part Type: НЁУГєсД¤µзЧи; Manufacturer PN: RC0402JR-0710KL; Created by: YTL
R2516 = RESISTOR_Dup1: Did Not Place.; Part Reference: R2516; Tolerance: 0%; Value: DNP; RK PN: DNP0402; Priority: A; PCB Footprint: R0402; Part Type: DNP; Manufacturer PN: DNP0402; Created by: JJJ
R2517 = RESISTOR_Dup1: НЁУГєсД¤µзЧи,4K7,+/-5%,R0402,1/16W.; Part Reference: R2517; Manufacturer PN: RC0402JR-074K7L; Manufacturer: YAGEO; Value: 4.7K; Wattage: 1/16W; Priority: A; PCB Footprint: R0402; Created by: YTL; Part Type: НЁУГєсД¤µзЧи; RK PN: RC0402JR-074K7L
R2518 = RESISTOR_Dup1: НЁУГєсД¤µзЧи,0R,+/-5%,R0402,1/16W.; Part Reference: R2518; Manufacturer PN: RC0402JR-070RL; Manufacturer: YAGEO; Wattage: 1/16W; Priority: A; PCB Footprint: R0402; Value: 0R; Created by: YTL; Part Type: НЁУГєсД¤µзЧи; RK PN: RC0402JR-070RL
R2519 = RESISTOR_Dup1: НЁУГєсД¤µзЧи,2R2,+/-5%,R0402,1/16W.; Part Reference: R2519; Manufacturer: YAGEO; Value: 2.2R; RK PN: RC0402JR-072R2L; Priority: A; Wattage: 1/16W; PCB Footprint: R0402; Part Type: НЁУГєсД¤µзЧи; Manufacturer PN: RC0402JR-072R2L; Created by: YTL
R2520 = RESISTOR_Dup1: НЁУГєсД¤µзЧи,2R2,+/-5%,R0402,1/16W.; Part Reference: R2520; Manufacturer: YAGEO; Value: 2.2R; RK PN: RC0402JR-072R2L; Priority: A; Wattage: 1/16W; PCB Footprint: R0402; Part Type: НЁУГєсД¤µзЧи; Manufacturer PN: RC0402JR-072R2L; Created by: YTL
R2521 = RESISTOR_Dup1: НЁУГєсД¤µзЧи,0R,+/-5%,R0402,1/16W.; Part Reference: R2521; Manufacturer: YAGEO; RK PN: RC0402JR-070RL; Priority: A; Wattage: 1/16W; PCB Footprint: R0402; Value: 0R; Part Type: НЁУГєсД¤µзЧи; Manufacturer PN: RC0402JR-070RL; Created by: YTL
R2522 = RESISTOR_Dup1: НЁУГєсД¤µзЧи,0R,+/-5%,R0402,1/16W.; Part Reference: R2522; Manufacturer PN: RC0402JR-070RL; Manufacturer: YAGEO; Wattage: 1/16W; Priority: A; PCB Footprint: R0402; Value: 0R; Created by: YTL; Part Type: НЁУГєсД¤µзЧи; RK PN: RC0402JR-070RL
R2523 = RESISTOR_Dup1: НЁУГєсД¤µзЧи,2R2,+/-5%,R0402,1/16W.; Part Reference: R2523; Manufacturer PN: RC0402JR-072R2L; Manufacturer: YAGEO; Value: 2.2R; Wattage: 1/16W; Priority: A; PCB Footprint: R0402; Created by: YTL; Part Type: НЁУГєсД¤µзЧи; RK PN: RC0402JR-072R2L
R2524 = RESISTOR_Dup1: НЁУГєсД¤µзЧи,2R2,+/-5%,R0402,1/16W.; Part Reference: R2524; Manufacturer: YAGEO; Value: 2.2R; RK PN: RC0402JR-072R2L; Priority: A; Wattage: 1/16W; PCB Footprint: R0402; Part Type: НЁУГєсД¤µзЧи; Manufacturer PN: RC0402JR-072R2L; Created by: YTL
R2525 = RESISTOR_Dup1: НЁУГєсД¤µзЧи,0R,+/-5%,R0402,1/16W.; Part Reference: R2525; Manufacturer: YAGEO; RK PN: RC0402JR-070RL; Priority: A; Wattage: 1/16W; PCB Footprint: R0402; Value: 0R; Part Type: НЁУГєсД¤µзЧи; Manufacturer PN: RC0402JR-070RL; Created by: YTL
R2526 = RESISTOR_Dup1: НЁУГєсД¤µзЧи,0R,+/-5%,R0805,1/8W.; Part Reference: R2526; Manufacturer PN: RC0805JR-070RL; Manufacturer: YAGEO; Wattage: 1/8W; Priority: A; Value: 0R; Created by: YTL; Part Type: НЁУГєсД¤µзЧи; RK PN: RC0805JR-070RL
R2527 = RESISTOR_Dup1: НЁУГєсД¤µзЧи,0R,+/-5%,R0402,1/16W.; Part Reference: R2527; Manufacturer: YAGEO; RK PN: RC0402JR-070RL; Priority: A; Wattage: 1/16W; PCB Footprint: R0402; Value: 0R; Part Type: НЁУГєсД¤µзЧи; Manufacturer PN: RC0402JR-070RL; Created by: YTL
R2528 = RESISTOR_Dup1: НЁУГєсД¤µзЧи,2R2,+/-5%,R0402,1/16W.; Part Reference: R2528; Manufacturer: YAGEO; Value: 2.2R; RK PN: RC0402JR-072R2L; Priority: A; Wattage: 1/16W; PCB Footprint: R0402; Part Type: НЁУГєсД¤µзЧи; Manufacturer PN: RC0402JR-072R2L; Created by: YTL
R2529 = RESISTOR_Dup1: НЁУГєсД¤µзЧи,10K,+/-5%,R0402,1/16W.; Part Reference: R2529; Manufacturer PN: RC0402JR-0710KL; Manufacturer: YAGEO; Wattage: 1/16W; Priority: A; PCB Footprint: R0402; Value: 10K; Created by: YTL; Part Type: НЁУГєсД¤µзЧи; RK PN: RC0402JR-0710KL
R2530 = RESISTOR_Dup1: НЁУГєсД¤µзЧи,2R2,+/-5%,R0402,1/16W.; Part Reference: R2530; Manufacturer PN: RC0402JR-072R2L; Manufacturer: YAGEO; Value: 2.2R; Wattage: 1/16W; Priority: A; PCB Footprint: R0402; Created by: YTL; Part Type: НЁУГєсД¤µзЧи; RK PN: RC0402JR-072R2L
R2531 = RESISTOR_Dup1: НЁУГєсД¤µзЧи,0R,+/-5%,R0402,1/16W.; Part Reference: R2531; Manufacturer: YAGEO; RK PN: RC0402JR-070RL; Priority: A; Wattage: 1/16W; PCB Footprint: R0402; Value: 0R; Part Type: НЁУГєсД¤µзЧи; Manufacturer PN: RC0402JR-070RL; Created by: YTL
R2532 = RESISTOR_Dup1: НЁУГєсД¤µзЧи,4K7,+/-5%,R0402,1/16W.; Part Reference: R2532; Manufacturer PN: RC0402JR-074K7L; Manufacturer: YAGEO; Value: 4.7K; Wattage: 1/16W; Priority: A; PCB Footprint: R0402; Created by: YTL; Part Type: НЁУГєсД¤µзЧи; RK PN: RC0402JR-074K7L
R2533 = RESISTOR_Dup1: НЁУГєсД¤µзЧи,100K,+/-5%,R0201,1/20W.; Part Reference: R2533; Manufacturer PN: RC0201JR-07100KL; Manufacturer: YAGEO; Wattage: 1/20W; Priority: A; Value: 100K; Created by: YTL; Part Type: НЁУГєсД¤µзЧи; RK PN: RC0201JR-07100KL
R2534 = RESISTOR_Dup1: НЁУГєсД¤µзЧи,100K,+/-5%,R0201,1/20W.; Part Reference: R2534; Manufacturer: YAGEO; RK PN: RC0201JR-07100KL; Priority: A; Wattage: 1/20W; Value: 100K; Part Type: НЁУГєсД¤µзЧи; Manufacturer PN: RC0201JR-07100KL; Created by: YTL
R2535 = RESISTOR_Dup1: НЁУГєсД¤µзЧи,2M,+/-5%,R0201,1/20W.; Part Reference: R2535; Manufacturer PN: RC0201JR-072ML; Manufacturer: YAGEO; Wattage: 1/20W; Priority: A; Value: 2M; Created by: YTL; Part Type: НЁУГєсД¤µзЧи; RK PN: RC0201JR-072ML
R2536 = RESISTOR_Dup1: НЁУГєсД¤µзЧи,2M,+/-5%,R0201,1/20W.; Part Reference: R2536; Manufacturer PN: RC0201JR-072ML; Manufacturer: YAGEO; Wattage: 1/20W; Priority: A; Value: 2M; Created by: YTL; Part Type: НЁУГєсД¤µзЧи; RK PN: RC0201JR-072ML
R2537 = RESISTOR_Dup1: НЁУГєсД¤µзЧи,0R,+/-5%,R0201,1/20W.; Part Reference: R2537; Manufacturer: YAGEO; RK PN: RC0201JR-070RL; Priority: A; Wattage: 1/20W; Value: 0R; Part Type: НЁУГєсД¤µзЧи; Manufacturer PN: RC0201JR-070RL; Created by: YTL
R2538 = RESISTOR_Dup1: НЁУГєсД¤µзЧи,0R,+/-5%,R0201,1/20W.; Part Reference: R2538; Manufacturer: YAGEO; RK PN: RC0201JR-070RL; Priority: A; Wattage: 1/20W; Value: 0R; Part Type: НЁУГєсД¤µзЧи; Manufacturer PN: RC0201JR-070RL; Created by: YTL
R2539 = RESISTOR_Dup1: НЁУГєсД¤µзЧи,0R,+/-5%,R1206,1/4W.; Part Reference: R2539; Manufacturer PN: RC1206JR-070RL; Manufacturer: YAGEO; Wattage: 1/4W; Priority: A; Value: 0R; Created by: YTL; Part Type: НЁУГєсД¤µзЧи; RK PN: RC1206JR-070RL
U2500 = SWITCH_SY6280: Low Loss Power Distribution Switch; Part Reference: U2500; Manufacturer: SilergyЈЁОщБ¦ЅЬЈ©; Value: SY6280AAC; Priority: A; PCB Footprint: SOT_23_5; Created by: JJJ; Manufacturer PN: SY6280AAC; Part Type: Switch; RK PN: SY6280AAC
U2501 = SWITCH_SY6280: Low Loss Power Distribution Switch; Part Reference: U2501; Manufacturer: SilergyЈЁОщБ¦ЅЬЈ©; Value: SY6280AAC; Priority: A; PCB Footprint: SOT_23_5; Created by: JJJ; Manufacturer PN: SY6280AAC; Part Type: Switch; RK PN: SY6280AAC
U2502 = SWITCH_SY6280: Low Loss Power Distribution Switch; Part Reference: U2502; Manufacturer: SilergyЈЁОщБ¦ЅЬЈ©; Value: SY6280AAC; Priority: A; PCB Footprint: SOT_23_5; Created by: JJJ; Manufacturer PN: SY6280AAC; Part Type: Switch; RK PN: SY6280AAC
U2503 = USB_FUSB302B: Programmable USB Type-C Controller w/PD; Part Reference: U2503; Manufacturer: Fairchild(·ЙХЧ°лµјМе); Value: FUSB302BMPX; Priority: A; PCB Footprint: MLP14_2R50X2R50X0R80; Created by: JJJ; Manufacturer PN: FUSB302BMPX; Part Type: USB; RK PN: FUSB302BMPX

## Sheet 38.DRAM-LPDDR4X_200P_1X32bit.SchDoc
size 500 x 400 mm; Revision: V2.1; Schematic Page Number: 11; Page Number: 24; Check: <Checker>; Schematic Name: RK_NVR_DEMO1_RK3588_LP4/4x_V21; Page Count: 43; Page name: 38.DRAM-LPDDR4X_200P_1X32bit; Designer: Zhangdz; Schematic Page Count: 99; Revcode: V2.1; DsnPath: E:\Work\SBER\RK3588_SOM\temp\RK_NVR_DEMO1_RK3588_LP4XD200P232SD8_V21_20211228.DSN; SchematicName: RK_NVR_DEMO1_RK3588_LP4/4x_V21; PageName: 38.DRAM-LPDDR4X_200P_1X32bit; PageSize: Custom; TopSchematic: True
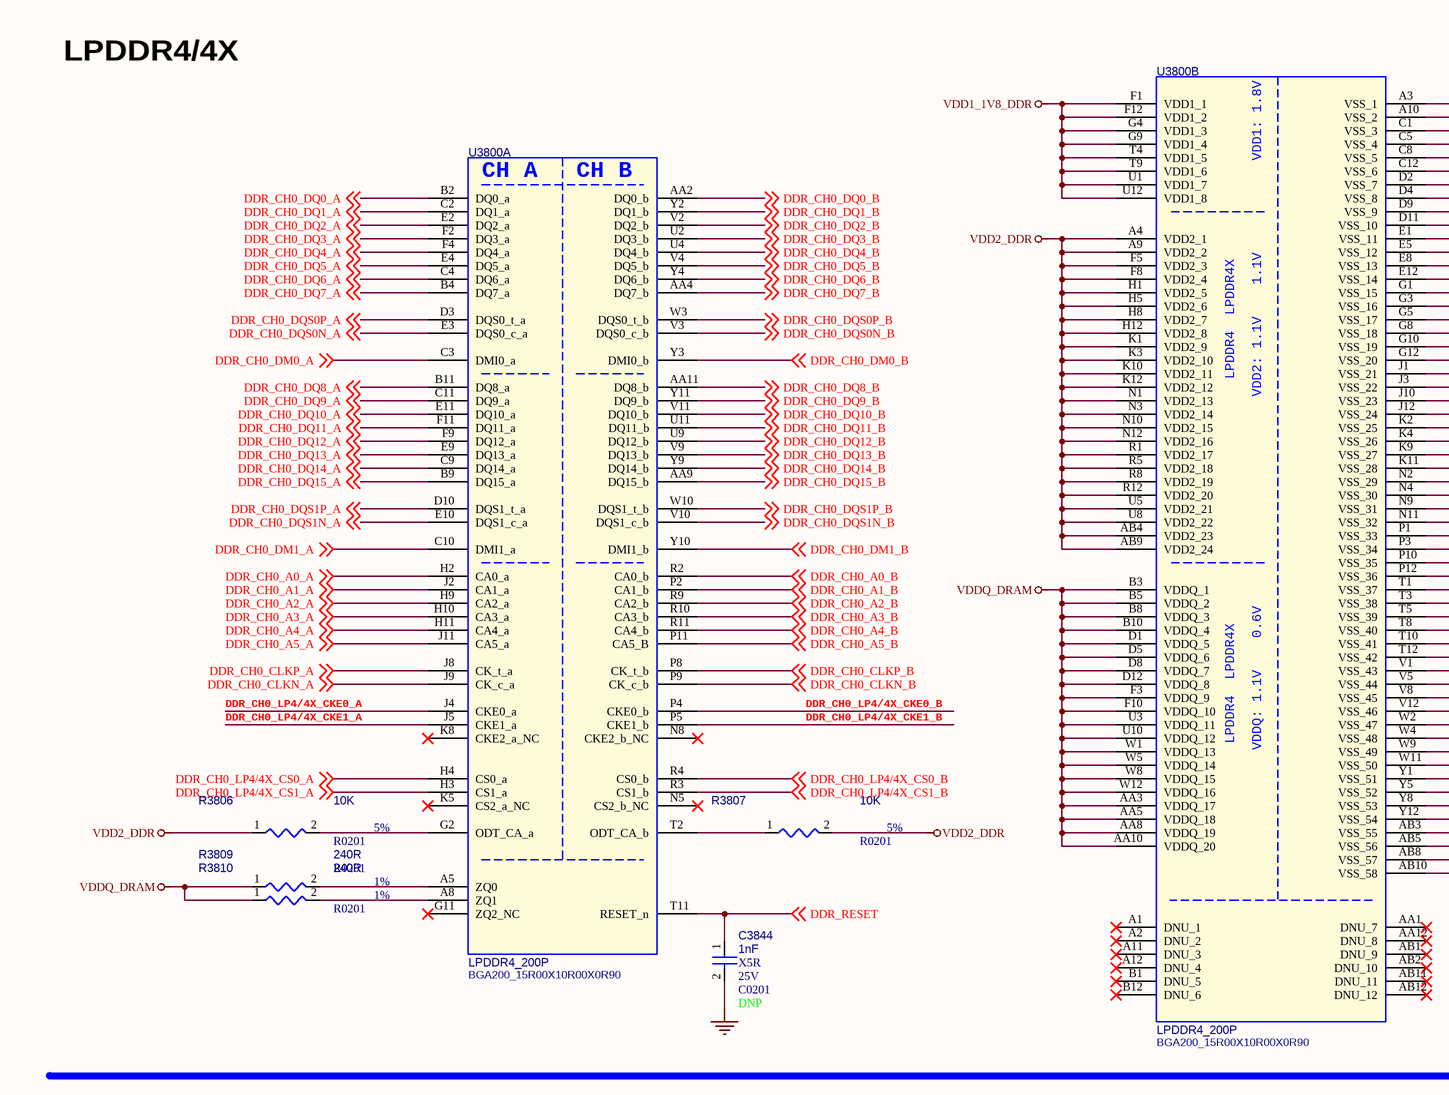
[diagram p48: 38.DRAM-LPDDR4X_200P_1X32bit.SchDoc, top left]
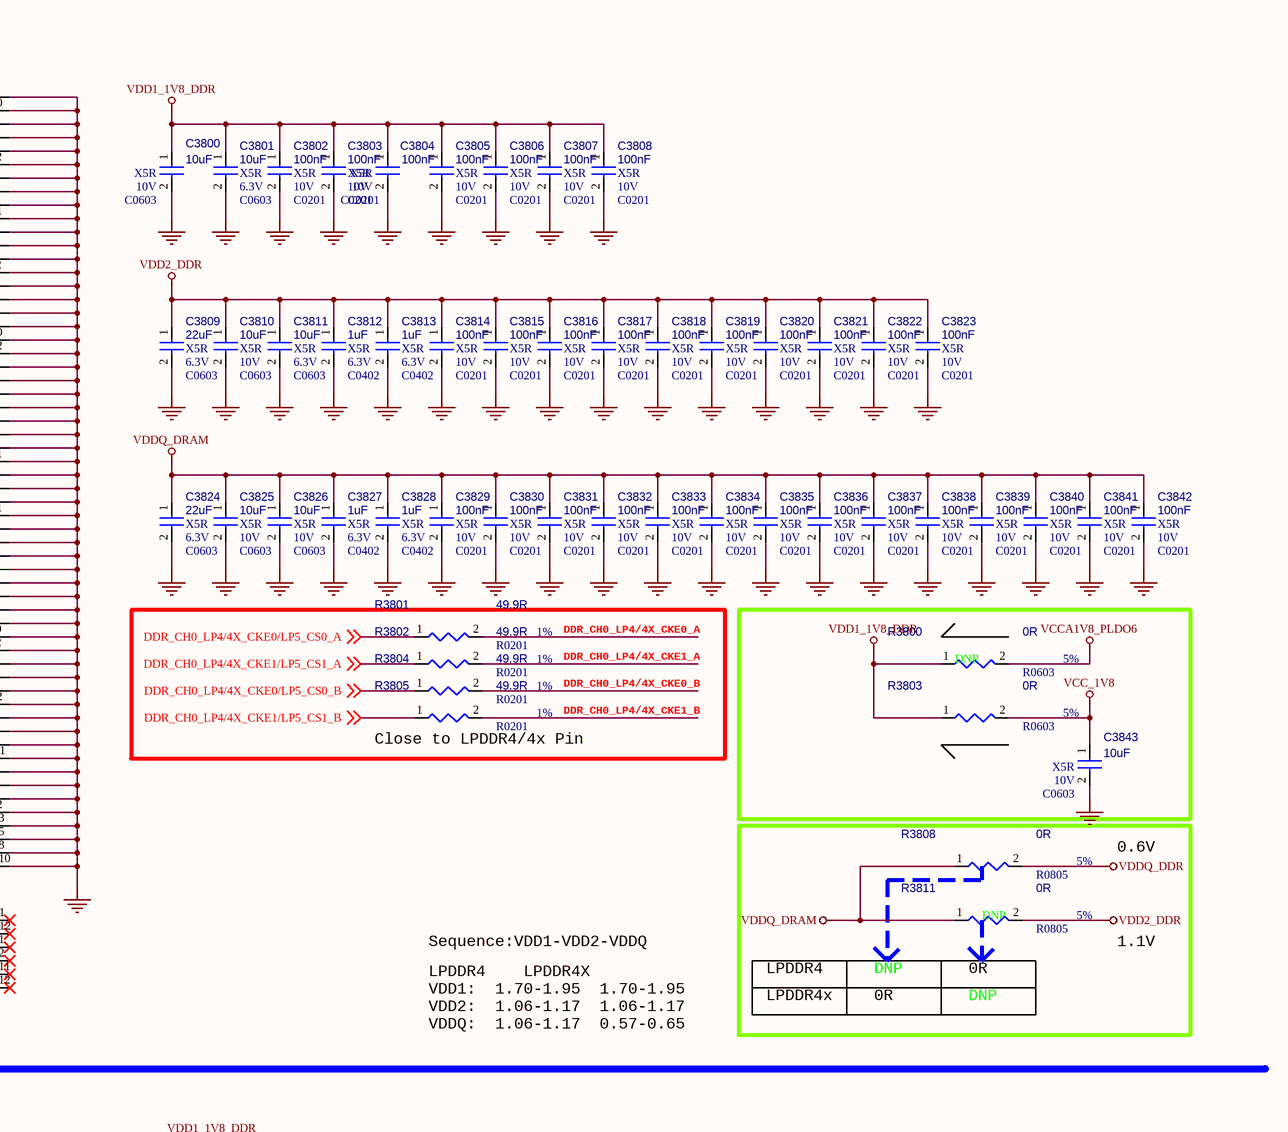
[diagram p49: 38.DRAM-LPDDR4X_200P_1X32bit.SchDoc, top right]
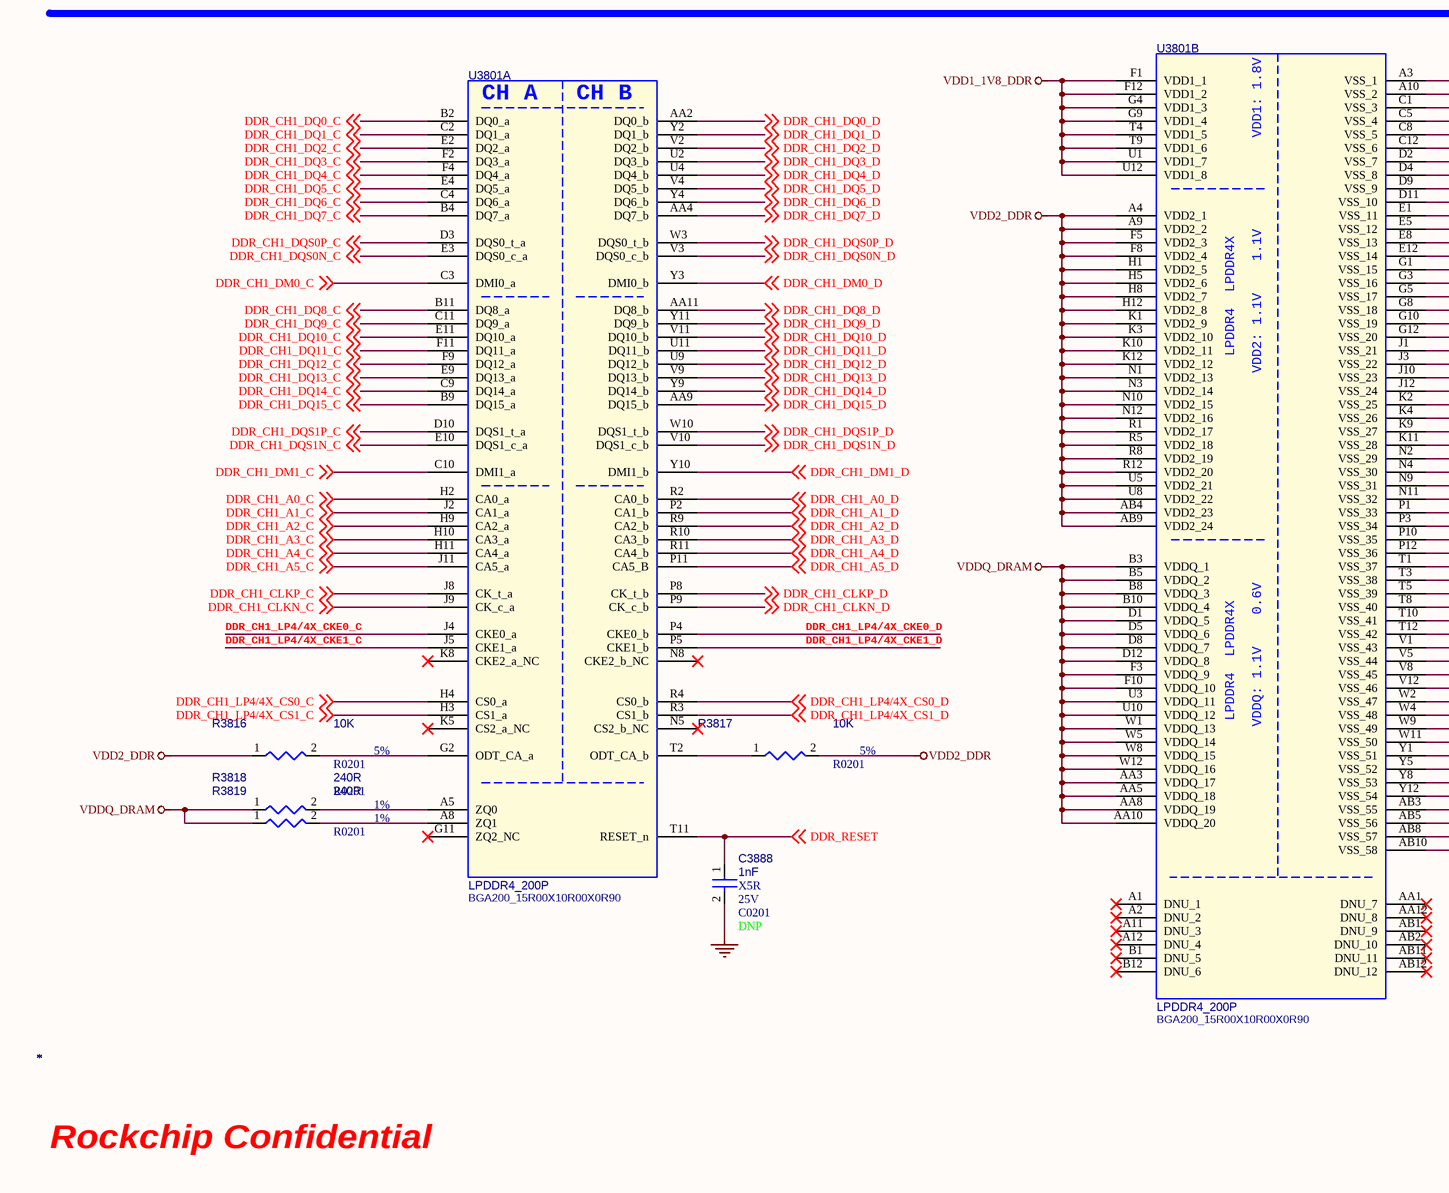
[diagram p50: 38.DRAM-LPDDR4X_200P_1X32bit.SchDoc, bottom left]
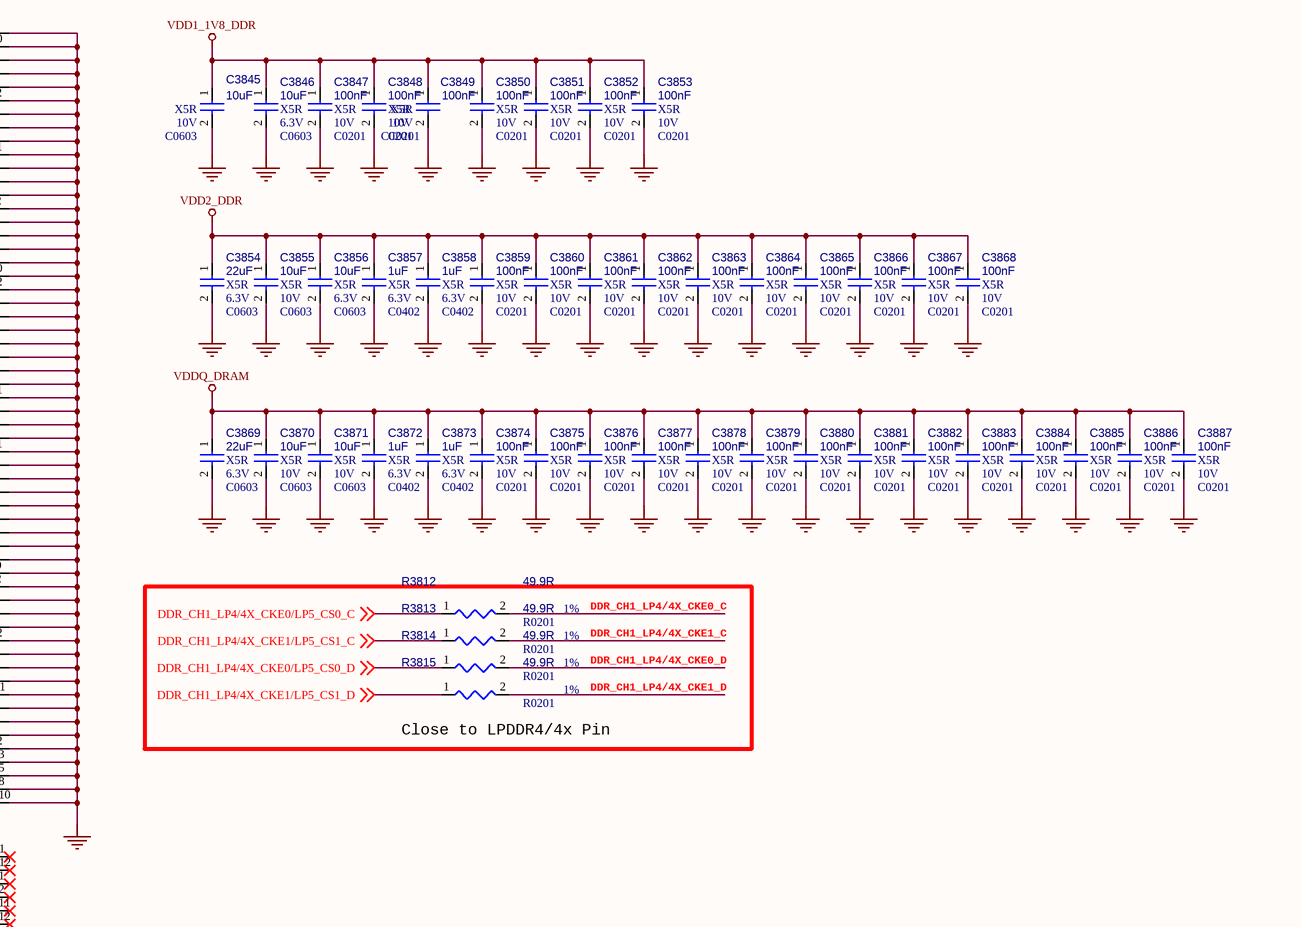
[diagram p51: 38.DRAM-LPDDR4X_200P_1X32bit.SchDoc, bottom right]

### Parts
C3800  *  Voltage: 10V  Dielectric: X5R  [C0603]
C3801  *  Voltage: 6.3V  Dielectric: X5R  [C0603]
C3802  *  Voltage: 10V  Dielectric: X5R  [C0201]
C3803  *  Voltage: 10V  Dielectric: X5R  [C0201]
C3804  *  Voltage: 10V  Dielectric: X5R  [C0201]
C3805  *  Voltage: 10V  Dielectric: X5R  [C0201]
C3806  *  Voltage: 10V  Dielectric: X5R  [C0201]
C3807  *  Voltage: 10V  Dielectric: X5R  [C0201]
C3808  *  Voltage: 10V  Dielectric: X5R  [C0201]
C3809  *  Voltage: 6.3V  Dielectric: X5R  [C0603]
C3810  *  Voltage: 10V  Dielectric: X5R  [C0603]
C3811  *  Voltage: 6.3V  Dielectric: X5R  [C0603]
C3812  *  Voltage: 6.3V  Dielectric: X5R  [C0402]
C3813  *  Voltage: 6.3V  Dielectric: X5R  [C0402]
C3814  *  Voltage: 10V  Dielectric: X5R  [C0201]
C3815  *  Voltage: 10V  Dielectric: X5R  [C0201]
C3816  *  Voltage: 10V  Dielectric: X5R  [C0201]
C3817  *  Voltage: 10V  Dielectric: X5R  [C0201]
C3818  *  Voltage: 10V  Dielectric: X5R  [C0201]
C3819  *  Voltage: 10V  Dielectric: X5R  [C0201]
C3820  *  Voltage: 10V  Dielectric: X5R  [C0201]
C3821  *  Voltage: 10V  Dielectric: X5R  [C0201]
C3822  *  Voltage: 10V  Dielectric: X5R  [C0201]
C3823  *  Voltage: 10V  Dielectric: X5R  [C0201]
C3824  *  Voltage: 6.3V  Dielectric: X5R  [C0603]
C3825  *  Voltage: 10V  Dielectric: X5R  [C0603]
C3826  *  Voltage: 10V  Dielectric: X5R  [C0603]
C3827  *  Voltage: 6.3V  Dielectric: X5R  [C0402]
C3828  *  Voltage: 6.3V  Dielectric: X5R  [C0402]
C3829  *  Voltage: 10V  Dielectric: X5R  [C0201]
C3830  *  Voltage: 10V  Dielectric: X5R  [C0201]
C3831  *  Voltage: 10V  Dielectric: X5R  [C0201]
C3832  *  Voltage: 10V  Dielectric: X5R  [C0201]
C3833  *  Voltage: 10V  Dielectric: X5R  [C0201]
C3834  *  Voltage: 10V  Dielectric: X5R  [C0201]
C3835  *  Voltage: 10V  Dielectric: X5R  [C0201]
C3836  *  Voltage: 10V  Dielectric: X5R  [C0201]
C3837  *  Voltage: 10V  Dielectric: X5R  [C0201]
C3838  *  Voltage: 10V  Dielectric: X5R  [C0201]
C3839  *  Voltage: 10V  Dielectric: X5R  [C0201]
C3840  *  Voltage: 10V  Dielectric: X5R  [C0201]
C3841  *  Voltage: 10V  Dielectric: X5R  [C0201]
C3842  *  Voltage: 10V  Dielectric: X5R  [C0201]
C3843  *  Voltage: 10V  Dielectric: X5R  [C0603]
C3844  *  Voltage: 25V  Dielectric: X5R  OPTION: DNP  [C0201]
C3845  *  Voltage: 10V  Dielectric: X5R  [C0603]
C3846  *  Voltage: 6.3V  Dielectric: X5R  [C0603]
C3847  *  Voltage: 10V  Dielectric: X5R  [C0201]
C3848  *  Voltage: 10V  Dielectric: X5R  [C0201]
C3849  *  Voltage: 10V  Dielectric: X5R  [C0201]
C3850  *  Voltage: 10V  Dielectric: X5R  [C0201]
C3851  *  Voltage: 10V  Dielectric: X5R  [C0201]
C3852  *  Voltage: 10V  Dielectric: X5R  [C0201]
C3853  *  Voltage: 10V  Dielectric: X5R  [C0201]
C3854  *  Voltage: 6.3V  Dielectric: X5R  [C0603]
C3855  *  Voltage: 10V  Dielectric: X5R  [C0603]
C3856  *  Voltage: 6.3V  Dielectric: X5R  [C0603]
C3857  *  Voltage: 6.3V  Dielectric: X5R  [C0402]
C3858  *  Voltage: 6.3V  Dielectric: X5R  [C0402]
C3859  *  Voltage: 10V  Dielectric: X5R  [C0201]
C3860  *  Voltage: 10V  Dielectric: X5R  [C0201]
C3861  *  Voltage: 10V  Dielectric: X5R  [C0201]
C3862  *  Voltage: 10V  Dielectric: X5R  [C0201]
C3863  *  Voltage: 10V  Dielectric: X5R  [C0201]
C3864  *  Voltage: 10V  Dielectric: X5R  [C0201]
C3865  *  Voltage: 10V  Dielectric: X5R  [C0201]
C3866  *  Voltage: 10V  Dielectric: X5R  [C0201]
C3867  *  Voltage: 10V  Dielectric: X5R  [C0201]
C3868  *  Voltage: 10V  Dielectric: X5R  [C0201]
C3869  *  Voltage: 6.3V  Dielectric: X5R  [C0603]
C3870  *  Voltage: 10V  Dielectric: X5R  [C0603]
C3871  *  Voltage: 10V  Dielectric: X5R  [C0603]
C3872  *  Voltage: 6.3V  Dielectric: X5R  [C0402]
C3873  *  Voltage: 6.3V  Dielectric: X5R  [C0402]
C3874  *  Voltage: 10V  Dielectric: X5R  [C0201]
C3875  *  Voltage: 10V  Dielectric: X5R  [C0201]
C3876  *  Voltage: 10V  Dielectric: X5R  [C0201]
C3877  *  Voltage: 10V  Dielectric: X5R  [C0201]
C3878  *  Voltage: 10V  Dielectric: X5R  [C0201]
C3879  *  Voltage: 10V  Dielectric: X5R  [C0201]
C3880  *  Voltage: 10V  Dielectric: X5R  [C0201]
C3881  *  Voltage: 10V  Dielectric: X5R  [C0201]
C3882  *  Voltage: 10V  Dielectric: X5R  [C0201]
C3883  *  Voltage: 10V  Dielectric: X5R  [C0201]
C3884  *  Voltage: 10V  Dielectric: X5R  [C0201]
C3885  *  Voltage: 10V  Dielectric: X5R  [C0201]
C3886  *  Voltage: 10V  Dielectric: X5R  [C0201]
C3887  *  Voltage: 10V  Dielectric: X5R  [C0201]
C3888  *  Voltage: 25V  Dielectric: X5R  OPTION: DNP  [C0201]
R3800  *  PCB Footprint: R0603  Tolerance: 5%  OPTION: DNP  [R0402]
R3801  *  PCB Footprint: R0201  Tolerance: 1%  [R0402]
R3802  *  PCB Footprint: R0201  Tolerance: 1%  [R0402]
R3803  *  PCB Footprint: R0603  Tolerance: 5%  [R0402]
R3804  *  PCB Footprint: R0201  Tolerance: 1%  [R0402]
R3805  *  PCB Footprint: R0201  Tolerance: 1%  [R0402]
R3806  *  PCB Footprint: R0201  Tolerance: 5%  [R0402]
R3807  *  PCB Footprint: R0201  Tolerance: 5%  [R0402]
R3808  *  PCB Footprint: R0805  Tolerance: 5%  [R0402]
R3809  *  PCB Footprint: R0201  Tolerance: 1%  [R0402]
R3810  *  PCB Footprint: R0201  Tolerance: 1%  [R0402]
R3811  *  PCB Footprint: R0805  Tolerance: 5%  OPTION: DNP  [R0402]
R3812  *  PCB Footprint: R0201  Tolerance: 1%  [R0402]
R3813  *  PCB Footprint: R0201  Tolerance: 1%  [R0402]
R3814  *  PCB Footprint: R0201  Tolerance: 1%  [R0402]
R3815  *  PCB Footprint: R0201  Tolerance: 1%  [R0402]
R3816  *  PCB Footprint: R0201  Tolerance: 5%  [R0402]
R3817  *  PCB Footprint: R0201  Tolerance: 5%  [R0402]
R3818  *  PCB Footprint: R0201  Tolerance: 1%  [R0402]
R3819  *  PCB Footprint: R0201  Tolerance: 1%  [R0402]
U3800  *  [BGA200_15R00X10R00X0R90]  (parts A,B of 2)
U3801  *  [BGA200_15R00X10R00X0R90]  (parts A,B of 2)

### Blocks framed on the sheet
Close to LPDDR4/4x Pin: R3801 R3802 R3804 R3805
Close to LPDDR4/4x Pin: R3812-R3815